# Altium project EPS.PrjPcb (part 3 of 4)

## Sheet EPS_Distribution_LCL-FPF.SchDoc: Distribution / LCL-FPF
size A4; ApprovedBy: (not approved); CheckedBy: (not checked); Author: Piotr Kuligowski; DocumentNumber: PWSat2-xxx-DW-xxx; Revision: 3; SheetNumber: 51; SheetTotal: 51; Model: FPM
Used 6 times, as channels Top/Distribution/LCL-FPF SunS 3V3, Top/Distribution/LCL-FPF CAMnadir 3V3, Top/Distribution/LCL-FPF CAMwing 3V3, Top/Distribution/LCL-FPF SENS 5V, Top/Distribution/LCL-FPF ANTs 5V, Top/Distribution/LCL-FPF ANTs 5V. Parts and nets are listed once, with the designators drawn on the sheet.
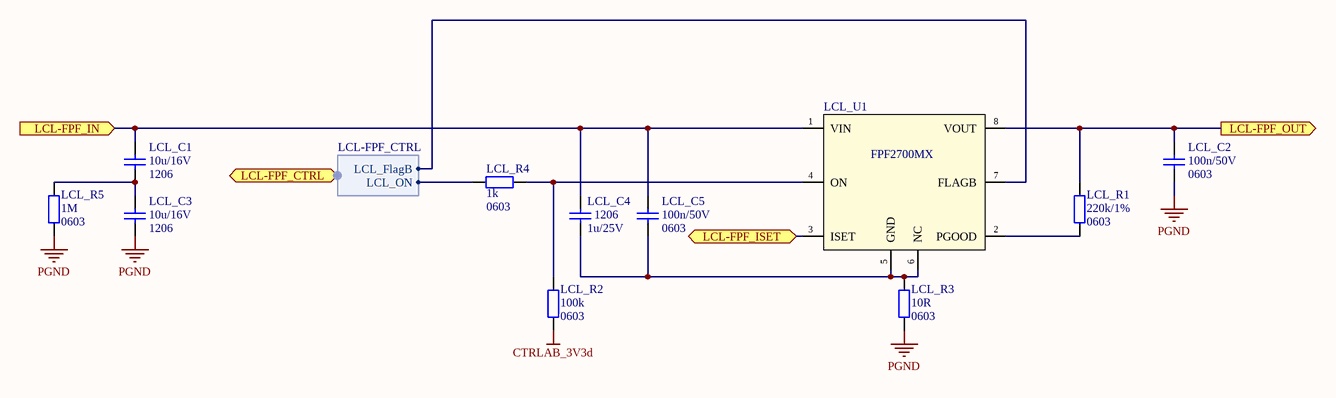
[diagram p23: EPS_Distribution_LCL-FPF.SchDoc]

### Parts
LCL_C1  Packge: 1206  [SMD_Capacitor_1206]  (hidden comment: 10u/16V)
LCL_C2  Package: 0603  [SMD_Capacitor_0603]  (hidden comment: 100n/50V)
LCL_C3  Packge: 1206  [SMD_Capacitor_1206]  (hidden comment: 10u/16V)
LCL_C4  Package: 1206  [SMD_Capacitor_1206]  (hidden comment: 1u/25V)
LCL_C5  Package: 0603  [SMD_Capacitor_0603]  (hidden comment: 100n/50V)
LCL_R1  Package: 0603  [SMD_Resistor_0603]  (hidden comment: 220k/1%)
LCL_R2  Package: 0603  [SMD_Resistor_0603]  (hidden comment: 100k)
LCL_R3  Package: 0603  [SMD_Resistor_0603]  (hidden comment: 10R)
LCL_R4  Package: 0603  [SMD_Resistor_0603]  (hidden comment: 1k)
LCL_R5  Package: 0603  [SMD_Resistor_0603]  (hidden comment: 1M)
LCL_U1  FPF2700MX  [SOIC-8-N]

### Ports
LCL-FPF_CTRL (harness LCL-FPF_CTRL), LCL-FPF_IN (in), LCL-FPF_ISET, LCL-FPF_OUT (out)

### Harnesses
LCL-FPF_CTRL: LCL_FlagB, LCL_ON

### Nets
CTRLAB_3V3d: LCL_R2.1
PGND: LCL_C2.2 LCL_C3.2 LCL_R3.1 LCL_R5.1
LCL-FPF_IN: LCL_C1.1 LCL_C4.1 LCL_C5.1 LCL_U1.1(VIN) ; port LCL-FPF_IN
LCL-FPF_ISET: LCL_U1.3(ISET) ; port LCL-FPF_ISET
LCL-FPF_OUT: LCL_C2.1 LCL_R1.2 LCL_U1.8(VOUT) ; port LCL-FPF_OUT
NetLCL_C1_2: LCL_C1.2 LCL_C3.1 LCL_R5.2
NetLCL_C4_2: LCL_C4.2 LCL_C5.2 LCL_R3.2 LCL_U1.5(GND) LCL_U1.6(NC)
NetLCL_R1_1: LCL_R1.1 LCL_U1.2(PGOOD)
NetLCL_R2_2: LCL_R2.2 LCL_R4.1 LCL_U1.4(ON)
NetLCL_R4_2: LCL_R4.2 ; port LCL-FPF_CTRL.LCL_ON
NetLCL_U1_7: LCL_U1.7(FLAGB) ; port LCL-FPF_CTRL.LCL_FlagB

### Channels
Top/Distribution/LCL-FPF SunS 3V3: designators end in _1; ports LCL-FPF_IN=NetHK_R1_2_1 LCL-FPF_ISET=NetDISTR_R1_2 LCL-FPF_OUT=PC-104_LCL_SunS_3V3
Top/Distribution/LCL-FPF CAMnadir 3V3: designators end in _2; ports LCL-FPF_IN=NetHK_R1_2_1 LCL-FPF_ISET=NetDISTR_R2_2 LCL-FPF_OUT=PC-104_LCL_CAMnadir_3V3
Top/Distribution/LCL-FPF CAMwing 3V3: designators end in _3; ports LCL-FPF_IN=NetHK_R1_2_1 LCL-FPF_ISET=NetDISTR_R3_2 LCL-FPF_OUT=PC-104_LCL_CAMwing_3V3
Top/Distribution/LCL-FPF SENS 5V: designators end in _4; ports LCL-FPF_IN=NetHK_R1_1_1 LCL-FPF_ISET=NetDISTR_R4_2 LCL-FPF_OUT=PC-104_LCL_SENS_5V
Top/Distribution/LCL-FPF ANTs 5V: designators end in _5; ports LCL-FPF_IN=NetHK_R1_1_1 LCL-FPF_ISET=NetDISTR_R5_2 LCL-FPF_OUT=NetH8_1
Top/Distribution/LCL-FPF ANTs 5V: designators end in _6; ports LCL-FPF_IN=NetHK_R1_1_1 LCL-FPF_ISET=NetDISTR_R6_2 LCL-FPF_OUT=NetH8_1

### Notes on the sheet
- Title:
- Project:
- Author:
- Model:
- Document Number:
- Checked by:
- Rev:
- Date:
- Approved by:
- Sheet:
- of
- File name:

### Library data of the parts
LCL_C1 LCL_C3 = Cer_C1206T106K4RACTU: Ceramic Cap Kemet COTS 10u/16V X7R 1206; ManufacturerPartNumber: C1206T106K4RACTU; Manufacturer: Kemet; Value: 10u/16V
LCL_C2 LCL_C5 = Cer_C0603T104K5RALTU: Ceramic Cap Kemet COTS 100n/50V X7R 0603; Manufacturer: Kemet; ManufacturerPartNumber: C0603T104K5RALTU; Value: 100n/50V
LCL_C4 = Cer_C1206T105K3RALTU: Ceramic Cap Kemet COTS 1u/25V X7R 1206; ManufacturerPartNumber: C1206T105K3RALTU; Manufacturer: Kemet; Value: 1u/25V
LCL_R1-LCL_R5 = Res
  LCL_R1: Value: 220k/1%
  LCL_R2: Value: 100k
  LCL_R3: Value: 10R
  LCL_R4: Value: 1k
  LCL_R5: Value: 1M
LCL_U1 = FPF2700MX: Adj over-current protection 0.4-2A, Load Switch; Manufacturer: Fairchild Semiconductor; Value: FPF2700MX

## Sheet EPS_Distribution_LCL-TK.SchDoc: Distribution / LCL-TK
size A3; ApprovedBy: (not approved); CheckedBy: (not checked); Author: Piotr Kuligowski; DocumentNumber: PWSat2-xxx-DW-xxx; Revision: 3; SheetNumber: 50; SheetTotal: 51; Model: FPM
Used 2 times, as channels Top/Distribution/LCL-TK MAIN, Top/Distribution/LCL-TK Redundant. Parts and nets are listed once, with the designators drawn on the sheet.
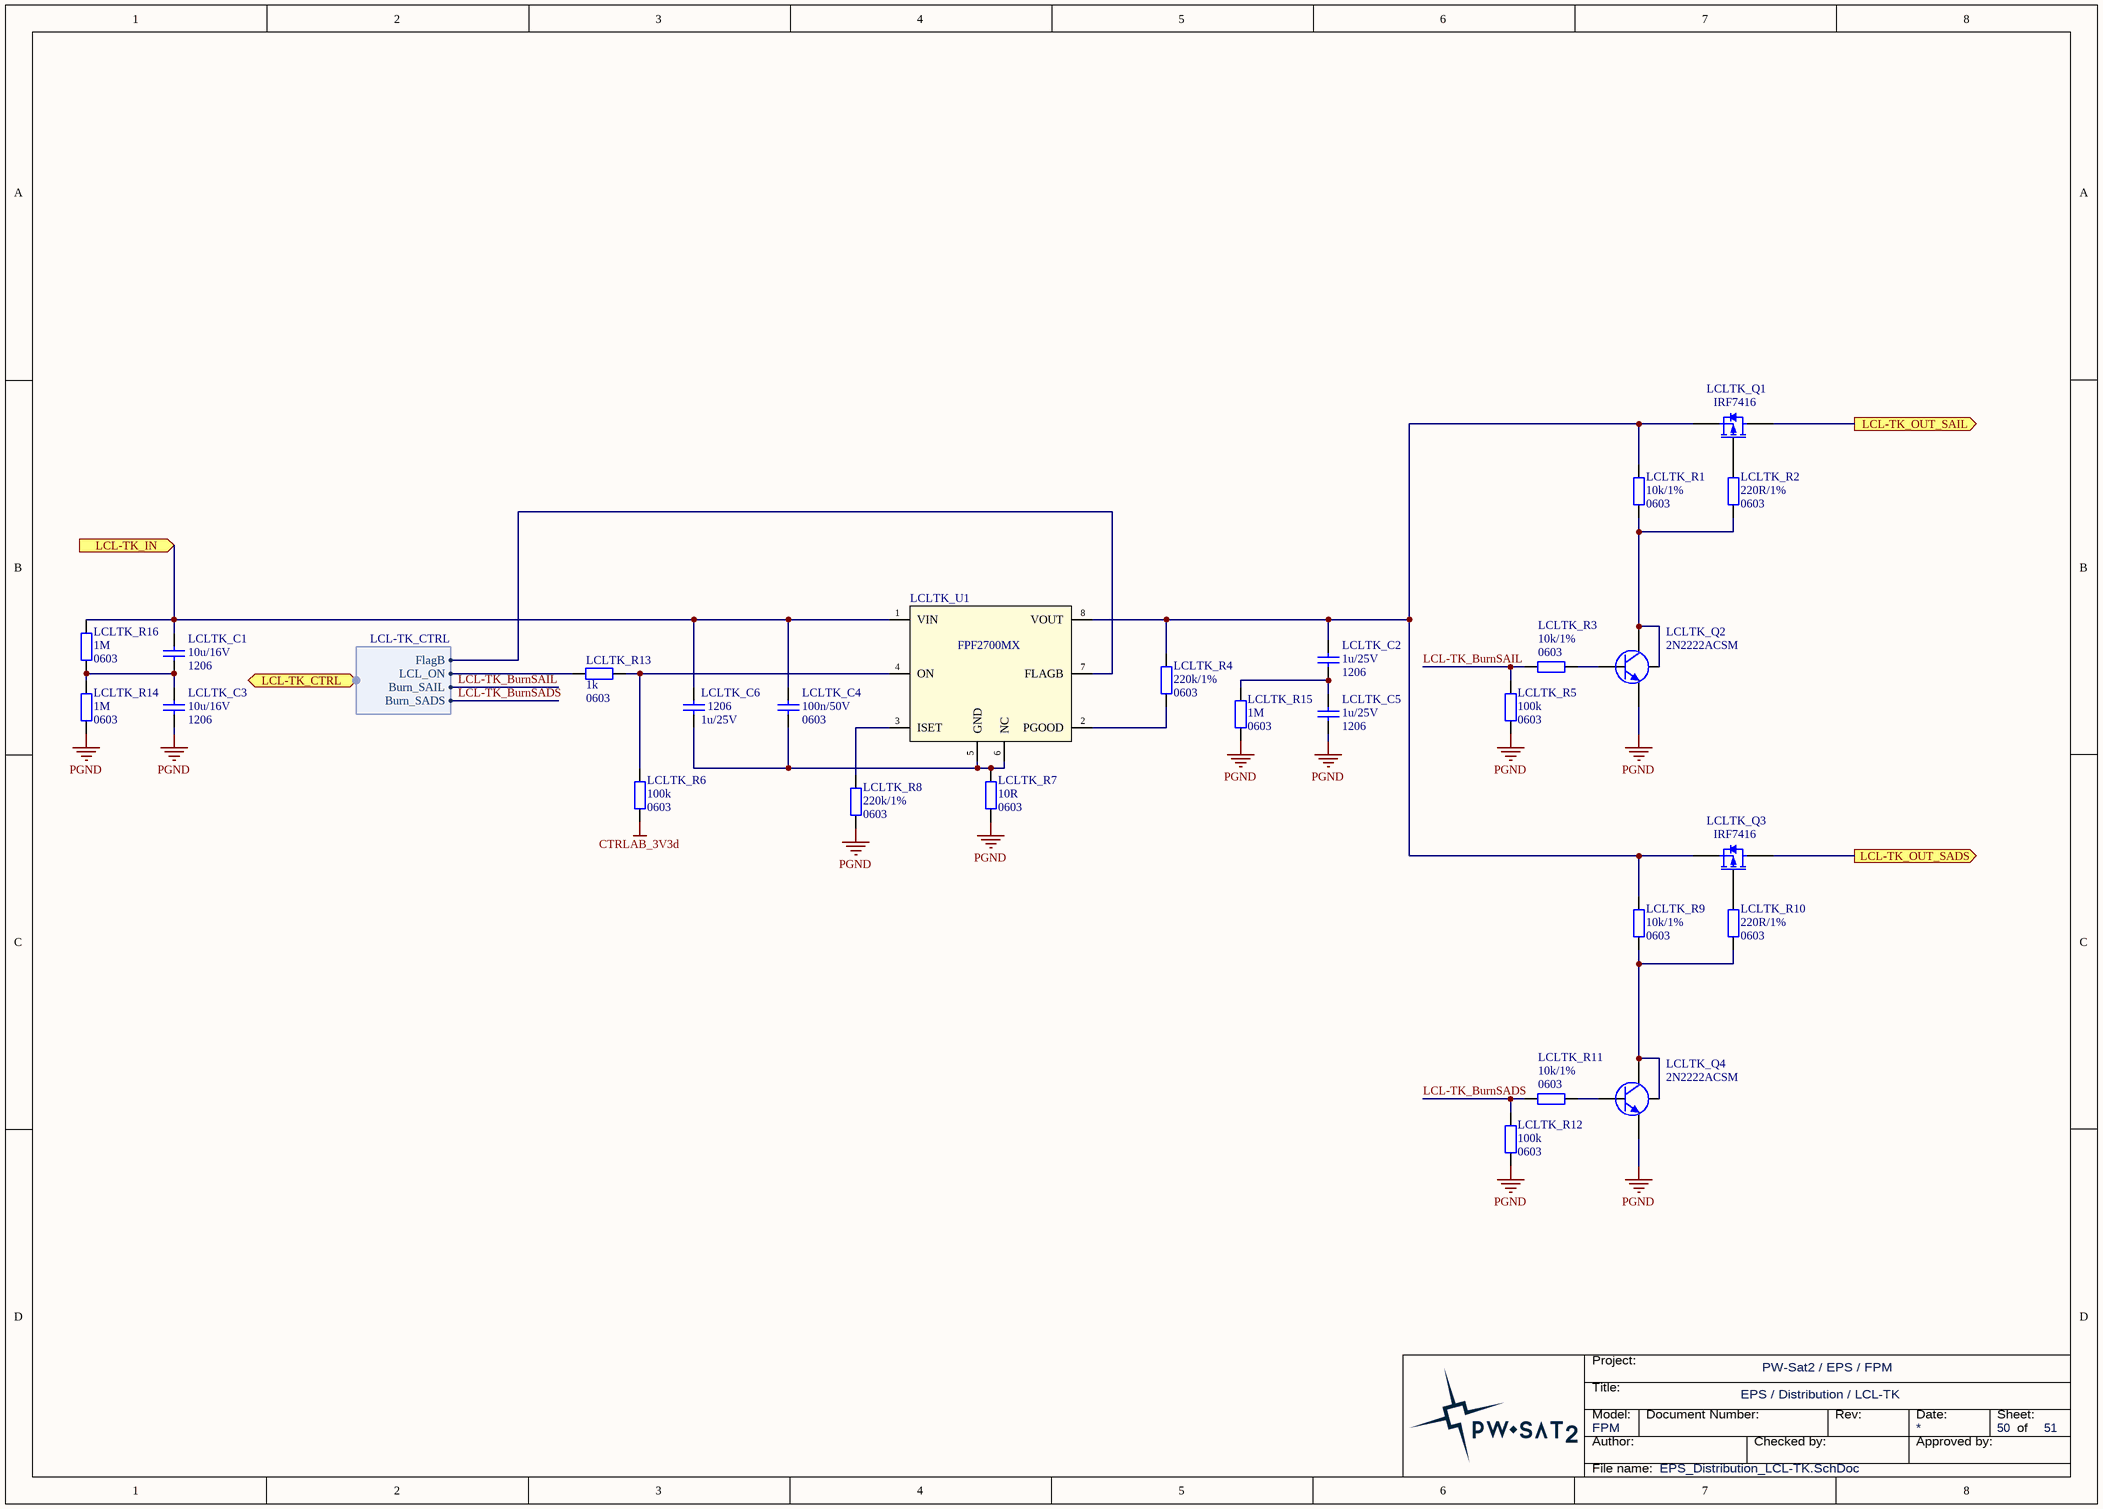
[diagram p24: EPS_Distribution_LCL-TK.SchDoc]

### Parts
LCLTK_C1  Packge: 1206  [SMD_Capacitor_1206]  (hidden comment: 10u/16V)
LCLTK_C2  Package: 1206  [SMD_Capacitor_1206]  (hidden comment: 1u/25V)
LCLTK_C3  Packge: 1206  [SMD_Capacitor_1206]  (hidden comment: 10u/16V)
LCLTK_C4  Package: 0603  [SMD_Capacitor_0603]  (hidden comment: 100n/50V)
LCLTK_C5  Package: 1206  [SMD_Capacitor_1206]  (hidden comment: 1u/25V)
LCLTK_C6  Package: 1206  [SMD_Capacitor_1206]  (hidden comment: 1u/25V)
LCLTK_Q1  IRF7416  [SOIC-8-N_SSSGDDDD]
LCLTK_Q2  2N2222ACSM  [LCC1-4_BEC]
LCLTK_Q3  IRF7416  [SOIC-8-N_SSSGDDDD]
LCLTK_Q4  2N2222ACSM  [LCC1-4_BEC]
LCLTK_R1  Package: 0603  [SMD_Resistor_0603]  (hidden comment: 10k/1%)
LCLTK_R2  Package: 0603  [SMD_Resistor_0603]  (hidden comment: 220R/1%)
LCLTK_R3  Package: 0603  [SMD_Resistor_0603]  (hidden comment: 10k/1%)
LCLTK_R4  Package: 0603  [SMD_Resistor_0603]  (hidden comment: 220k/1%)
LCLTK_R5  Package: 0603  [SMD_Resistor_0603]  (hidden comment: 100k)
LCLTK_R6  Package: 0603  [SMD_Resistor_0603]  (hidden comment: 100k)
LCLTK_R7  Package: 0603  [SMD_Resistor_0603]  (hidden comment: 10R)
LCLTK_R8  Package: 0603  [SMD_Resistor_0603]  (hidden comment: 220k/1%)
LCLTK_R9  Package: 0603  [SMD_Resistor_0603]  (hidden comment: 10k/1%)
LCLTK_R10  Package: 0603  [SMD_Resistor_0603]  (hidden comment: 220R/1%)
LCLTK_R11  Package: 0603  [SMD_Resistor_0603]  (hidden comment: 10k/1%)
LCLTK_R12  Package: 0603  [SMD_Resistor_0603]  (hidden comment: 100k)
LCLTK_R13  Package: 0603  [SMD_Resistor_0603]  (hidden comment: 1k)
LCLTK_R14  Package: 0603  [SMD_Resistor_0603]  (hidden comment: 1M)
LCLTK_R15  Package: 0603  [SMD_Resistor_0603]  (hidden comment: 1M)
LCLTK_R16  Package: 0603  [SMD_Resistor_0603]  (hidden comment: 1M)
LCLTK_U1  FPF2700MX  [SOIC-8-N]

### Ports
LCL-TK_CTRL (harness LCL-TK_CTRL), LCL-TK_IN (in), LCL-TK_OUT_SADS (out), LCL-TK_OUT_SAIL (out)

### Harnesses
LCL-TK_CTRL: FlagB, LCL_ON, Burn_SAIL, Burn_SADS

### Nets
CTRLAB_3V3d: LCLTK_R6.1
PGND: LCLTK_C3.2 LCLTK_C5.2 LCLTK_Q2.E LCLTK_Q4.E LCLTK_R5.1 LCLTK_R7.1 LCLTK_R8.1 LCLTK_R12.1 LCLTK_R14.1 LCLTK_R15.1
LCL-TK_BurnSADS: LCLTK_R11.2 LCLTK_R12.2 ; port LCL-TK_CTRL.Burn_SADS
LCL-TK_BurnSAIL: LCLTK_R3.2 LCLTK_R5.2 ; port LCL-TK_CTRL.Burn_SAIL
LCL-TK_IN: LCLTK_C1.1 LCLTK_C4.1 LCLTK_C6.1 LCLTK_R16.2 LCLTK_U1.1(VIN) ; port LCL-TK_IN
LCL-TK_OUT_SADS: LCLTK_Q3.D ; port LCL-TK_OUT_SADS
LCL-TK_OUT_SAIL: LCLTK_Q1.D ; port LCL-TK_OUT_SAIL
NetLCLTK_C1_2: LCLTK_C1.2 LCLTK_C3.1 LCLTK_R14.2 LCLTK_R16.1
NetLCLTK_C2_1: LCLTK_C2.1 LCLTK_Q1.S LCLTK_Q3.S LCLTK_R1.2 LCLTK_R4.2 LCLTK_R9.2 LCLTK_U1.8(VOUT)
NetLCLTK_C2_2: LCLTK_C2.2 LCLTK_C5.1 LCLTK_R15.2
NetLCLTK_C4_2: LCLTK_C4.2 LCLTK_C6.2 LCLTK_R7.2 LCLTK_U1.5(GND) LCLTK_U1.6(NC)
NetLCLTK_Q1_G: LCLTK_Q1.G LCLTK_R2.2
NetLCLTK_Q2_B: LCLTK_Q2.B LCLTK_R3.1
NetLCLTK_Q2_C: LCLTK_Q2.C LCLTK_Q2.Shield LCLTK_R1.1 LCLTK_R2.1
NetLCLTK_Q3_G: LCLTK_Q3.G LCLTK_R10.2
NetLCLTK_Q4_B: LCLTK_Q4.B LCLTK_R11.1
NetLCLTK_Q4_C: LCLTK_Q4.C LCLTK_Q4.Shield LCLTK_R9.1 LCLTK_R10.1
NetLCLTK_R4_1: LCLTK_R4.1 LCLTK_U1.2(PGOOD)
NetLCLTK_R6_2: LCLTK_R6.2 LCLTK_R13.1 LCLTK_U1.4(ON)
NetLCLTK_R8_2: LCLTK_R8.2 LCLTK_U1.3(ISET)
NetLCLTK_R13_2: LCLTK_R13.2 ; port LCL-TK_CTRL.LCL_ON
NetLCLTK_U1_7: LCLTK_U1.7(FLAGB) ; port LCL-TK_CTRL.FlagB

### Channels
Top/Distribution/LCL-TK MAIN: designators end in _1; ports LCL-TK_IN=NetDRLCL_C1_1_1 LCL-TK_OUT_SADS=PC-104_LCL_SADSmain LCL-TK_OUT_SAIL=PC-104_LCL_SAILmain
Top/Distribution/LCL-TK Redundant: designators end in _2; ports LCL-TK_IN=NetDRLCL_C1_1_1 LCL-TK_OUT_SADS=PC-104_LCL_SADSred LCL-TK_OUT_SAIL=PC-104_LCL_SAILred

### Notes on the sheet
- Title:
- Project:
- Author:
- Model:
- Document Number:
- Checked by:
- Rev:
- Date:
- Approved by:
- Sheet:
- of
- File name:

### Library data of the parts
LCLTK_C1 LCLTK_C3 = Cer_C1206T106K4RACTU: Ceramic Cap Kemet COTS 10u/16V X7R 1206; ManufacturerPartNumber: C1206T106K4RACTU; Manufacturer: Kemet; Value: 10u/16V
LCLTK_C2 LCLTK_C5 LCLTK_C6 = Cer_C1206T105K3RALTU: Ceramic Cap Kemet COTS 1u/25V X7R 1206; ManufacturerPartNumber: C1206T105K3RALTU; Manufacturer: Kemet; Value: 1u/25V
LCLTK_C4 = Cer_C0603T104K5RALTU: Ceramic Cap Kemet COTS 100n/50V X7R 0603; Manufacturer: Kemet; ManufacturerPartNumber: C0603T104K5RALTU; Value: 100n/50V
LCLTK_Q1 LCLTK_Q3 = IRF7416: 10A/30V HEXFET Power P-MOSFET.; Manufacturer: International Rectifier; Value: IRF7416
LCLTK_Q2 LCLTK_Q4 = 2N2222ACSM: as RBL_Q2 on sheet EPS_RBL; Value: 2N2222ACSM
LCLTK_R1-LCLTK_R16 = Res
  LCLTK_R1 LCLTK_R3 LCLTK_R9 LCLTK_R11: Value: 10k/1%
  LCLTK_R2 LCLTK_R10: Value: 220R/1%
  LCLTK_R4 LCLTK_R8: Value: 220k/1%
  LCLTK_R5 LCLTK_R6 LCLTK_R12: Value: 100k
  LCLTK_R7: Value: 10R
  LCLTK_R13: Value: 1k
  LCLTK_R14-LCLTK_R16: Value: 1M
LCLTK_U1 = FPF2700MX: as LCL_U1 on sheet EPS_Distribution_LCL-FPF; Value: FPF2700MX

## Sheet EPS_Distribution_RLCL-FPF.SchDoc: Distribution / RLCL-FPF
size A4; ApprovedBy: (not approved); CheckedBy: (not checked); Author: Piotr Kuligowski; DocumentNumber: PWSat2-xxx-DW-xxx; Revision: 3; SheetNumber: 49; SheetTotal: 51; Model: FPM
Used 2 times, as channels Top/Distribution/RLCL-FPF 5V, Top/Distribution/RLCL-FPF 3V3. Parts and nets are listed once, with the designators drawn on the sheet.
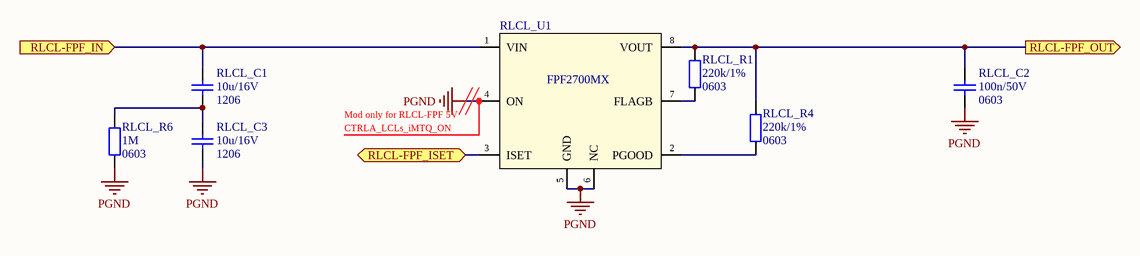
[diagram p25: EPS_Distribution_RLCL-FPF.SchDoc]

### Parts
RLCL_C1  Packge: 1206  [SMD_Capacitor_1206]  (hidden comment: 10u/16V)
RLCL_C2  Package: 0603  [SMD_Capacitor_0603]  (hidden comment: 100n/50V)
RLCL_C3  Packge: 1206  [SMD_Capacitor_1206]  (hidden comment: 10u/16V)
RLCL_R1  Package: 0603  [SMD_Resistor_0603]  (hidden comment: 220k/1%)
RLCL_R4  Package: 0603  [SMD_Resistor_0603]  (hidden comment: 220k/1%)
RLCL_R6  Package: 0603  [SMD_Resistor_0603]  (hidden comment: 1M)
RLCL_U1  FPF2700MX  [SOIC-8-N]

### Ports
RLCL-FPF_IN (in), RLCL-FPF_ISET, RLCL-FPF_OUT (out)

### Nets
PGND: RLCL_C2.2 RLCL_C3.2 RLCL_R6.1 RLCL_U1.4(ON) RLCL_U1.5(GND) RLCL_U1.6(NC)
RLCL-FPF_IN: RLCL_C1.1 RLCL_U1.1(VIN) ; port RLCL-FPF_IN
RLCL-FPF_ISET: RLCL_U1.3(ISET) ; port RLCL-FPF_ISET
RLCL-FPF_OUT: RLCL_C2.1 RLCL_R1.2 RLCL_R4.2 RLCL_U1.8(VOUT) ; port RLCL-FPF_OUT
NetRLCL_C1_2: RLCL_C1.2 RLCL_C3.1 RLCL_R6.2
NetRLCL_R1_1: RLCL_R1.1 RLCL_U1.7(FLAGB)
NetRLCL_R4_1: RLCL_R4.1 RLCL_U1.2(PGOOD)

### Channels
Top/Distribution/RLCL-FPF 5V: designators end in _1; ports RLCL-FPF_IN=NetHK_R1_1_1 RLCL-FPF_ISET=NetDISTR_R8_2 RLCL-FPF_OUT=PC-104_LCL_5V
Top/Distribution/RLCL-FPF 3V3: designators end in _2; ports RLCL-FPF_IN=NetHK_R1_2_1 RLCL-FPF_ISET=NetDISTR_R7_2 RLCL-FPF_OUT=PC-104_LCL_3V3

### Notes on the sheet
- CTRLA_LCLs_iMTQ_ON
- (near RLCL_U1) Mod only for RLCL-FPF 5V
- Title:
- Project:
- Author:
- Model:
- Document Number:
- Checked by:
- Rev:
- Date:
- Approved by:
- Sheet:
- of
- File name:

### Library data of the parts
RLCL_C1 RLCL_C3 = Cer_C1206T106K4RACTU: Ceramic Cap Kemet COTS 10u/16V X7R 1206; ManufacturerPartNumber: C1206T106K4RACTU; Manufacturer: Kemet; Value: 10u/16V
RLCL_C2 = Cer_C0603T104K5RALTU: Ceramic Cap Kemet COTS 100n/50V X7R 0603; Manufacturer: Kemet; ManufacturerPartNumber: C0603T104K5RALTU; Value: 100n/50V
RLCL_R1 RLCL_R4 RLCL_R6 = Res
  RLCL_R1 RLCL_R4: Value: 220k/1%
  RLCL_R6: Value: 1M
RLCL_U1 = FPF2700MX: Adj over-current protection 0.4-2A with auto-reset, Load Switch; Manufacturer: Fairchild Semiconductor; Value: FPF2700MX

## Sheet EPS_Distribution_Measurements.SchDoc: Distribution / Measurements
size A4; ApprovedBy: (not approved); CheckedBy: (not checked); Author: Piotr Kuligowski; DocumentNumber: PWSat2-xxx-DW-xxx; Revision: 3; SheetNumber: 48; SheetTotal: 51; Model: FPM
Used 3 times, as channels Top/Distribution/5V Measurements, Top/Distribution/3V3 Measurements, Top/Distribution/VBAT Measurements. Parts and nets are listed once, with the designators drawn on the sheet.
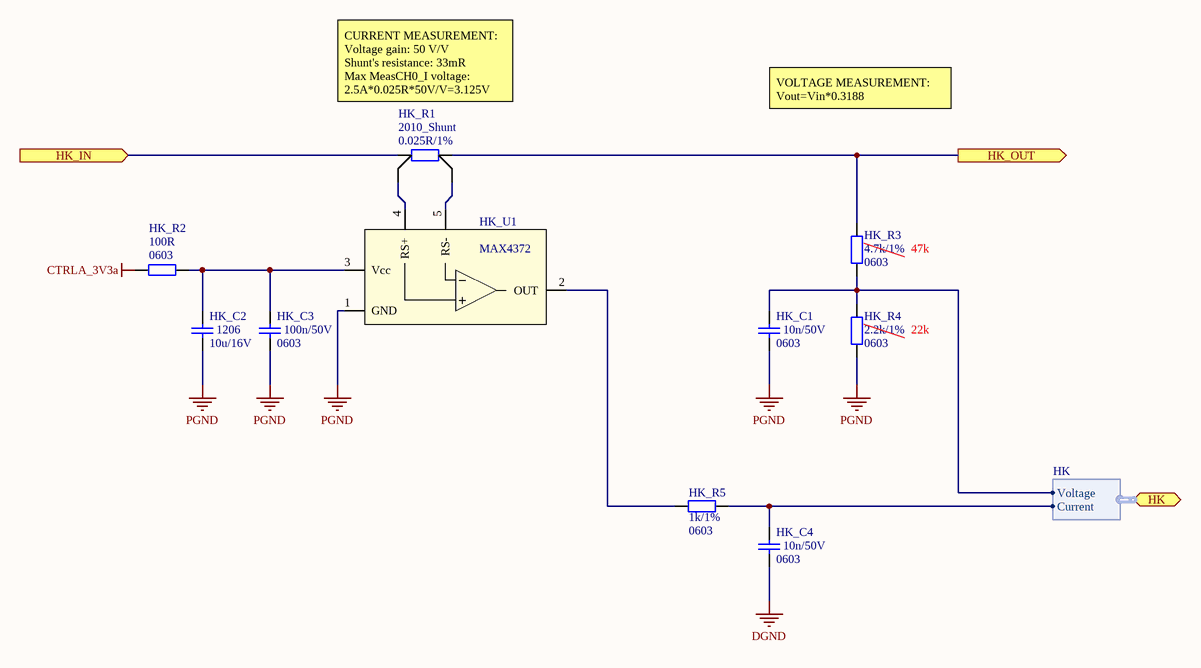
[diagram p26: EPS_Distribution_Measurements.SchDoc]

### Parts
HK_C1  Package: 0603  [SMD_Capacitor_0603]  (hidden comment: 10n/50V)
HK_C2  Packge: 1206  [SMD_Capacitor_1206]  (hidden comment: 10u/16V)
HK_C3  Package: 0603  [SMD_Capacitor_0603]  (hidden comment: 100n/50V)
HK_C4  Package: 0603  [SMD_Capacitor_0603]  (hidden comment: 10n/50V)
HK_R1  Package: 2010_Shunt  [SMD_Resistor-shunt_2010]  (hidden comment: 0.025R/1%)
HK_R2  Package: 0603  [SMD_Resistor_0603]  (hidden comment: 100R)
HK_R3  Package: 0603  [SMD_Resistor_0603]  (hidden comment: 4.7k/1%)
HK_R4  Package: 0603  [SMD_Resistor_0603]  (hidden comment: 2.2k/1%)
HK_R5  Package: 0603  [SMD_Resistor_0603]  (hidden comment: 1k/1%)
HK_U1  MAX4372  [SOT23-5]

### Ports
HK (harness HK), HK_IN (in), HK_OUT (out)

### Harnesses
HK: Voltage, Current

### Nets
CTRLA_3V3a: HK_R2.1
DGND: HK_C4.2
PGND: HK_C1.2 HK_C2.2 HK_C3.2 HK_R4.2 HK_U1.1(GND)
HK_IN: HK_R1.4 ; port HK_IN
HK_OUT: HK_R1.1 HK_R3.1 ; port HK_OUT
NetHK_C1_1: HK_C1.1 HK_R3.2 HK_R4.1 ; port HK.Voltage
NetHK_C2_1: HK_C2.1 HK_C3.1 HK_R2.2 HK_U1.3(Vcc)
NetHK_C4_1: HK_C4.1 HK_R5.2 ; port HK.Current
NetHK_R1_2: HK_R1.2 HK_U1.5(RS-)
NetHK_R1_3: HK_R1.3 HK_U1.4(RS+)
NetHK_R5_1: HK_R5.1 HK_U1.2(OUT)

### Channels
Top/Distribution/5V Measurements: designators end in _1; ports HK_IN=NetEMIBB_C1_1 HK_OUT=NetHK_R1_1_1
Top/Distribution/3V3 Measurements: designators end in _2; ports HK_IN=NetHK_R1_2_4 HK_OUT=NetHK_R1_2_1
Top/Distribution/VBAT Measurements: designators end in _3; ports HK_IN=NetHK_R1_3_4 HK_OUT=PC-104_LCL_VBAT

### Notes on the sheet
- CURRENT MEASUREMENT:
  Voltage gain: 50 V/V
  Shunt's resistance: 33mR
  Max MeasCH0_I voltage: 2.5A*0.025R*50V/V=3.125V
- VOLTAGE MEASUREMENT:
  Vout=Vin*0.3188
- 47k
- 22k
- Title:
- Project:
- Author:
- Model:
- Document Number:
- Checked by:
- Rev:
- Date:
- Approved by:
- Sheet:
- of
- File name:

### Library data of the parts
HK_C1 HK_C3 HK_C4 = Cer_C0603T104K5RALTU: Ceramic Cap Kemet COTS 100n/50V X7R 0603; Manufacturer: Kemet; ManufacturerPartNumber: C0603T104K5RALTU
  HK_C1 HK_C4: Value: 10n/50V
  HK_C3: Value: 100n/50V
HK_C2 = Cer_C1206T106K4RACTU: Ceramic Cap Kemet COTS 10u/16V X7R 1206; ManufacturerPartNumber: C1206T106K4RACTU; Manufacturer: Kemet; Value: 10u/16V
HK_R1 = CS10FTHTR025: 1W current sensing shunt resistor; Manufacturer: Viking; Supplier 1: TME; TME: CS2010-0R025-1%-HP; ManufacturerPartNumber: CS10FTHTR025; Value: 0.025R/1%
HK_R2-HK_R5 = Res
  HK_R2: Value: 100R
  HK_R3: Value: 4.7k/1%
  HK_R4: Value: 2.2k/1%
  HK_R5: Value: 1k/1%
HK_U1 = MAX4372: as MEAS_U1 on sheet EPS_MPPT_XY_Measurements; Value: MAX4372

## Sheet EPS_VBAT.SchDoc: VBAT
size A4; ApprovedBy: (not approved); CheckedBy: (not checked); Author: Piotr Kuligowski; DocumentNumber: PWSat2-xxx-DW-xxx; Revision: 3; SheetNumber: 37; SheetTotal: 51; Model: FPM
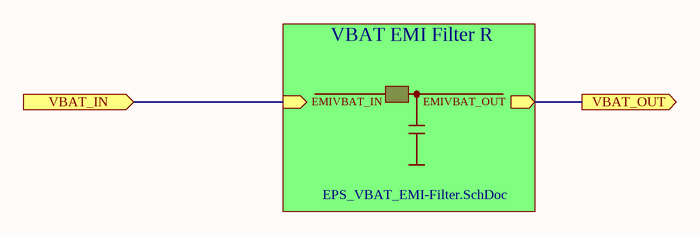
[diagram p27: EPS_VBAT.SchDoc]

### Sub-sheets
VBAT EMI Filter R = EPS_VBAT_EMI-Filter.SchDoc (file not in this document): EMIVBAT_OUT (out), EMIVBAT_IN (in)

### Ports
VBAT_IN (in), VBAT_OUT (out)

### Nets
NetDRLCL_C4_2_1: port VBAT_IN, sheet VBAT EMI Filter R/EMIVBAT_IN
NetHK_R1_3_4: port VBAT_OUT, sheet VBAT EMI Filter R/EMIVBAT_OUT

### Notes on the sheet
- Title:
- Project:
- Author:
- Model:
- Document Number:
- Checked by:
- Rev:
- Date:
- Approved by:
- Sheet:
- of
- File name:

## Sheet EPS_DCDC_RLCLs.SchDoc: DCDC / RLCLs
size A4; ApprovedBy: (not approved); CheckedBy: (not checked); Author: Piotr Kuligowski; DocumentNumber: PWSat2-xxx-DW-xxx; Revision: 3; SheetNumber: 36; SheetTotal: 51; Model: FPM
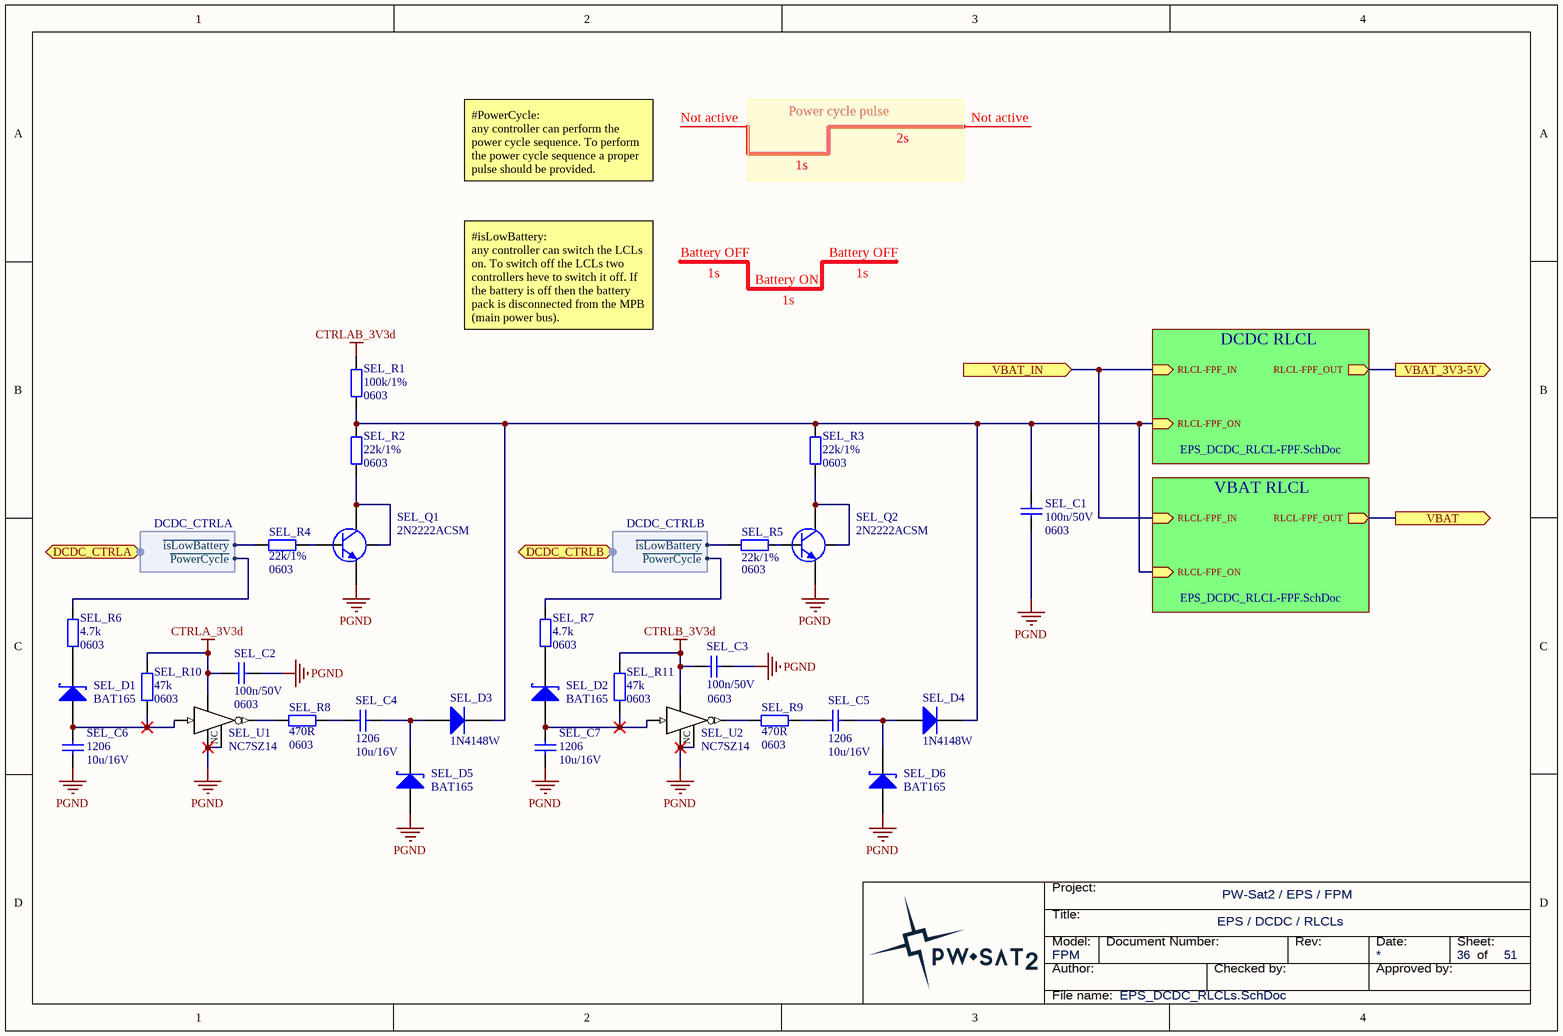
[diagram p28: EPS_DCDC_RLCLs.SchDoc]

### Parts
SEL_C1  value 100n/50V  Package: 0603  [SMD_Capacitor_0603]  (hidden comment: Cap)
SEL_C2  Package: 0603  [SMD_Capacitor_0603]  (hidden comment: 100n/50V)
SEL_C3  Package: 0603  [SMD_Capacitor_0603]  (hidden comment: 100n/50V)
SEL_C4  Packge: 1206  [SMD_Capacitor_1206]  (hidden comment: 10u/16V)
SEL_C5  Packge: 1206  [SMD_Capacitor_1206]  (hidden comment: 10u/16V)
SEL_C6  Packge: 1206  [SMD_Capacitor_1206]  (hidden comment: 10u/16V)
SEL_C7  Packge: 1206  [SMD_Capacitor_1206]  (hidden comment: 10u/16V)
SEL_D1  BAT165  [SOD323]
SEL_D2  BAT165  [SOD323]
SEL_D3  1N4148W  [SOD-123]
SEL_D4  1N4148W  [SOD-123]
SEL_D5  BAT165  [SOD323]
SEL_D6  BAT165  [SOD323]
SEL_Q1  2N2222ACSM  [LCC1-4_BEC]
SEL_Q2  2N2222ACSM  [LCC1-4_BEC]
SEL_R1  Package: 0603  [SMD_Resistor_0603]  (hidden comment: 100k/1%)
SEL_R2  Package: 0603  [SMD_Resistor_0603]  (hidden comment: 22k/1%)
SEL_R3  Package: 0603  [SMD_Resistor_0603]  (hidden comment: 22k/1%)
SEL_R4  Package: 0603  [SMD_Resistor_0603]  (hidden comment: 22k/1%)
SEL_R5  Package: 0603  [SMD_Resistor_0603]  (hidden comment: 22k/1%)
SEL_R6  Package: 0603  [SMD_Resistor_0603]  (hidden comment: 4.7k)
SEL_R7  Package: 0603  [SMD_Resistor_0603]  (hidden comment: 4.7k)
SEL_R8  Package: 0603  [SMD_Resistor_0603]  (hidden comment: 470R)
SEL_R9  Package: 0603  [SMD_Resistor_0603]  (hidden comment: 470R)
SEL_R10  Package: 0603  [SMD_Resistor_0603]  (hidden comment: 47k)
SEL_R11  Package: 0603  [SMD_Resistor_0603]  (hidden comment: 47k)
SEL_U1  NC7SZ14  [SOT23-5]
SEL_U2  NC7SZ14  [SOT23-5]

### Sub-sheets
DCDC RLCL = EPS_DCDC_RLCL-FPF.SchDoc: RLCL-FPF_IN (in), RLCL-FPF_OUT (out), RLCL-FPF_ON (in)
VBAT RLCL = EPS_DCDC_RLCL-FPF.SchDoc: RLCL-FPF_IN (in), RLCL-FPF_OUT (out), RLCL-FPF_ON (in)

### Ports
DCDC_CTRLA (harness DCDC_CTRLA), DCDC_CTRLB (harness DCDC_CTRLB), VBAT (out), VBAT_3V3-5V (out), VBAT_IN (in)

### Harnesses
DCDC_CTRLB: ~{PowerCycle}, ~{isLowBattery}
DCDC_CTRLA: ~{PowerCycle}, ~{isLowBattery}

### Nets
CTRLA_3V3d: SEL_C2.1 SEL_R10.2 SEL_U1.5(Vcc)
CTRLAB_3V3d: SEL_R1.2
CTRLB_3V3d: SEL_C3.1 SEL_R11.2 SEL_U2.5(Vcc)
PGND: SEL_C1.2 SEL_C2.2 SEL_C3.2 SEL_C6.1 SEL_C7.1 SEL_D5.A SEL_D6.A SEL_Q1.E SEL_Q2.E SEL_U1.1(NC) SEL_U1.3(GND) SEL_U2.1(NC) SEL_U2.3(GND)
NetCTRLB_U1_13: SEL_R5.1 ; port DCDC_CTRLB.~{isLowBattery}
NetCTRLB_U1_14: SEL_R7.2 ; port DCDC_CTRLB.~{PowerCycle}
NetDRLCL_C1_1_1: port VBAT_IN, sheet DCDC RLCL/RLCL-FPF_IN, sheet VBAT RLCL/RLCL-FPF_IN
NetDRLCL_C4_1_1: port VBAT_3V3-5V, sheet DCDC RLCL/RLCL-FPF_OUT
NetDRLCL_C4_2_1: port VBAT, sheet VBAT RLCL/RLCL-FPF_OUT
NetDRLCL_U1_1_4: SEL_C1.1 SEL_D3.K SEL_D4.K SEL_R1.1 SEL_R2.2 SEL_R3.2 ; sheet DCDC RLCL/RLCL-FPF_ON, sheet VBAT RLCL/RLCL-FPF_ON
NetSEL_C4_1: SEL_C4.1 SEL_R8.2
NetSEL_C4_2: SEL_C4.2 SEL_D3.A SEL_D5.K
NetSEL_C5_1: SEL_C5.1 SEL_R9.2
NetSEL_C5_2: SEL_C5.2 SEL_D4.A SEL_D6.K
NetSEL_C6_2: SEL_C6.2 SEL_D1.A SEL_R10.1 SEL_U1.2(A)
NetSEL_C7_2: SEL_C7.2 SEL_D2.A SEL_R11.1 SEL_U2.2(A)
NetSEL_D1_K: SEL_D1.K SEL_R6.1
NetSEL_D2_K: SEL_D2.K SEL_R7.1
NetSEL_Q1_B: SEL_Q1.B SEL_R4.2
NetSEL_Q1_C: SEL_Q1.C SEL_Q1.Shield SEL_R2.1
NetSEL_Q2_B: SEL_Q2.B SEL_R5.2
NetSEL_Q2_C: SEL_Q2.C SEL_Q2.Shield SEL_R3.1
NetSEL_R4_1: SEL_R4.1 ; port DCDC_CTRLA.~{isLowBattery}
NetSEL_R6_2: SEL_R6.2 ; port DCDC_CTRLA.~{PowerCycle}
NetSEL_R8_1: SEL_R8.1 SEL_U1.4(Y)
NetSEL_R9_1: SEL_R9.1 SEL_U2.4(Y)

### Notes on the sheet
- Power cycle pulse
- #PowerCycle:
  any controller can perform the power cycle sequence. To perform the power cycle sequence a proper pulse should be provided.
- Not active
- 1s
- 2s
- Battery OFF
- Battery ON
- #isLowBattery:
  any controller can switch the LCLs on. To switch off the LCLs two controllers heve to switch it off. If the battery is off then the battery pack is disconnected from the MPB (main power bus).
- Title:
- Project:
- Author:
- Model:
- Document Number:
- Checked by:
- Rev:
- Date:
- Approved by:
- Sheet:
- of
- File name:

### Library data of the parts
SEL_C2 SEL_C3 = Cer_C0603T104K5RALTU: Ceramic Cap Kemet COTS 100n/50V X7R 0603; Manufacturer: Kemet; ManufacturerPartNumber: C0603T104K5RALTU; Value: 100n/50V
SEL_C4-SEL_C7 = Cer_C1206T106K4RACTU: Ceramic Cap Kemet COTS 10u/16V X7R 1206; ManufacturerPartNumber: C1206T106K4RACTU; Manufacturer: Kemet; Value: 10u/16V
SEL_D1 SEL_D2 SEL_D5 SEL_D6 = BAT165: Madium Power AF Schottky 750mA 40V Diode; Manufacturer: Infineon; Value: BAT165
SEL_D3 SEL_D4 = 1N4148W: Small Signal Fast Switching Diode; Manufacturer: Vishay; Value: 1N4148W
SEL_Q1 SEL_Q2 = 2N2222ACSM: Silicon Planar Epitaxial NPN Transistor.; Manufacturer: Semelab-TT; Value: 2N2222ACSM
SEL_R1-SEL_R11 = Res
  SEL_R1: Value: 100k/1%
  SEL_R2-SEL_R5: Value: 22k/1%
  SEL_R6 SEL_R7: Value: 4.7k
  SEL_R8 SEL_R9: Value: 470R
  SEL_R10 SEL_R11: Value: 47k
SEL_U1 SEL_U2 = NC7SZ14: TinyLogic UHS TinyLogic UHS Two-Input NAND Gate.; Manufacturer: Fairchild Semiconductor; Value: NC7SZ14

## Sheet EPS_DCDC_RLCL-FPF.SchDoc: DCDC / RLCL-FPF
size A4; ApprovedBy: (not approved); CheckedBy: (not checked); Author: Piotr Kuligowski; DocumentNumber: PWSat2-xxx-DW-xxx; Revision: 3; SheetNumber: 35; SheetTotal: 51; Model: FPM
Used 2 times, as channels Top/LCLs for DCDC/DCDC RLCL, Top/LCLs for DCDC/VBAT RLCL. Parts and nets are listed once, with the designators drawn on the sheet.
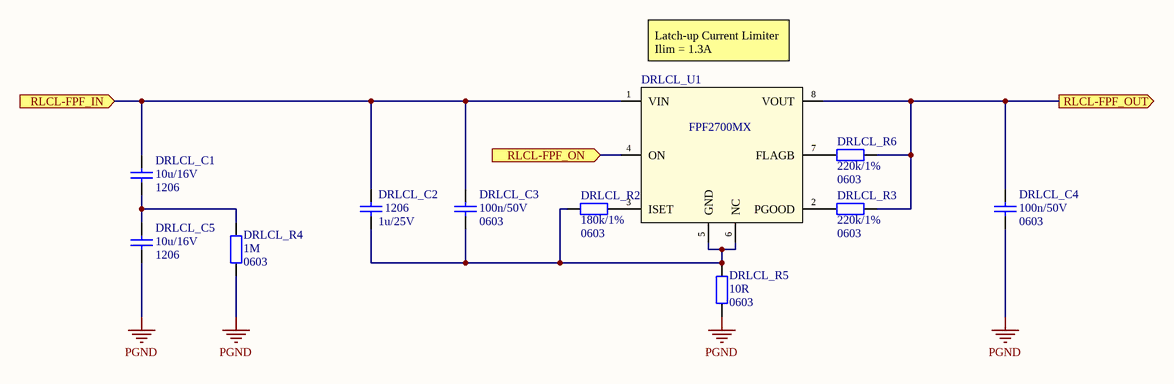
[diagram p29: EPS_DCDC_RLCL-FPF.SchDoc]

### Parts
DRLCL_C1  Packge: 1206  [SMD_Capacitor_1206]  (hidden comment: 10u/16V)
DRLCL_C2  Package: 1206  [SMD_Capacitor_1206]  (hidden comment: 1u/25V)
DRLCL_C3  Package: 0603  [SMD_Capacitor_0603]  (hidden comment: 100n/50V)
DRLCL_C4  Package: 0603  [SMD_Capacitor_0603]  (hidden comment: 100n/50V)
DRLCL_C5  Packge: 1206  [SMD_Capacitor_1206]  (hidden comment: 10u/16V)
DRLCL_R2  Package: 0603  [SMD_Resistor_0603]  (hidden comment: 180k/1%)
DRLCL_R3  Package: 0603  [SMD_Resistor_0603]  (hidden comment: 220k/1%)
DRLCL_R4  Package: 0603  [SMD_Resistor_0603]  (hidden comment: 1M)
DRLCL_R5  Package: 0603  [SMD_Resistor_0603]  (hidden comment: 10R)
DRLCL_R6  Package: 0603  [SMD_Resistor_0603]  (hidden comment: 220k/1%)
DRLCL_U1  FPF2700MX  [SOIC-8-N]

### Ports
RLCL-FPF_IN (in), RLCL-FPF_ON (in), RLCL-FPF_OUT (out)

### Nets
PGND: DRLCL_C4.2 DRLCL_C5.2 DRLCL_R4.1 DRLCL_R5.2
RLCL-FPF_IN: DRLCL_C1.1 DRLCL_C2.1 DRLCL_C3.1 DRLCL_U1.1(VIN) ; port RLCL-FPF_IN
RLCL-FPF_ON: DRLCL_U1.4(ON) ; port RLCL-FPF_ON
RLCL-FPF_OUT: DRLCL_C4.1 DRLCL_R3.2 DRLCL_R6.2 DRLCL_U1.8(VOUT) ; port RLCL-FPF_OUT
NetDRLCL_C1_2: DRLCL_C1.2 DRLCL_C5.1 DRLCL_R4.2
NetDRLCL_C2_2: DRLCL_C2.2 DRLCL_C3.2 DRLCL_R2.1 DRLCL_R5.1 DRLCL_U1.5(GND) DRLCL_U1.6(NC)
NetDRLCL_R2_2: DRLCL_R2.2 DRLCL_U1.3(ISET)
NetDRLCL_R3_1: DRLCL_R3.1 DRLCL_U1.2(PGOOD)
NetDRLCL_R6_1: DRLCL_R6.1 DRLCL_U1.7(FLAGB)

### Channels
Top/LCLs for DCDC/DCDC RLCL: designators end in _1; ports RLCL-FPF_IN=NetDRLCL_C1_1_1 RLCL-FPF_ON=NetDRLCL_U1_1_4 RLCL-FPF_OUT=NetDRLCL_C4_1_1
Top/LCLs for DCDC/VBAT RLCL: designators end in _2; ports RLCL-FPF_IN=NetDRLCL_C1_1_1 RLCL-FPF_ON=NetDRLCL_U1_1_4 RLCL-FPF_OUT=NetDRLCL_C4_2_1

### Notes on the sheet
- (near DRLCL_U1) Latch-up Current Limiter
  Ilim = 1.3A
- Title:
- Project:
- Author:
- Model:
- Document Number:
- Checked by:
- Rev:
- Date:
- Approved by:
- Sheet:
- of
- File name:

### Library data of the parts
DRLCL_C1 DRLCL_C5 = Cer_C1206T106K4RACTU: Ceramic Cap Kemet COTS 10u/16V X7R 1206; ManufacturerPartNumber: C1206T106K4RACTU; Manufacturer: Kemet; Value: 10u/16V
DRLCL_C2 = Cer_C1206T105K3RALTU: Ceramic Cap Kemet COTS 1u/25V X7R 1206; ManufacturerPartNumber: C1206T105K3RALTU; Manufacturer: Kemet; Value: 1u/25V
DRLCL_C3 DRLCL_C4 = Cer_GCJ188R71H104KA12D: Ceramic Cap Murata Automotive 100n/50V X7R 0603; Manufacturer: Murata; ManufacturerPartNumber: GCJ188R71H104KA12D; Value: 100n/50V
DRLCL_R2-DRLCL_R6 = Res
  DRLCL_R2: Value: 180k/1%
  DRLCL_R3 DRLCL_R6: Value: 220k/1%
  DRLCL_R4: Value: 1M
  DRLCL_R5: Value: 10R
DRLCL_U1 = FPF2700MX: Adj over-current protection 0.4-2A, Load Switch; Manufacturer: Fairchild Semiconductor; Value: FPF2700MX

## Sheet EPS_Local-Supply.SchDoc: Local Supply
size A4; ApprovedBy: (not approved); CheckedBy: (not checked); Author: Piotr Kuligowski; DocumentNumber: PWSat2-xxx-DW-xxx; Revision: 3; SheetNumber: 33; SheetTotal: 51; Model: FPM
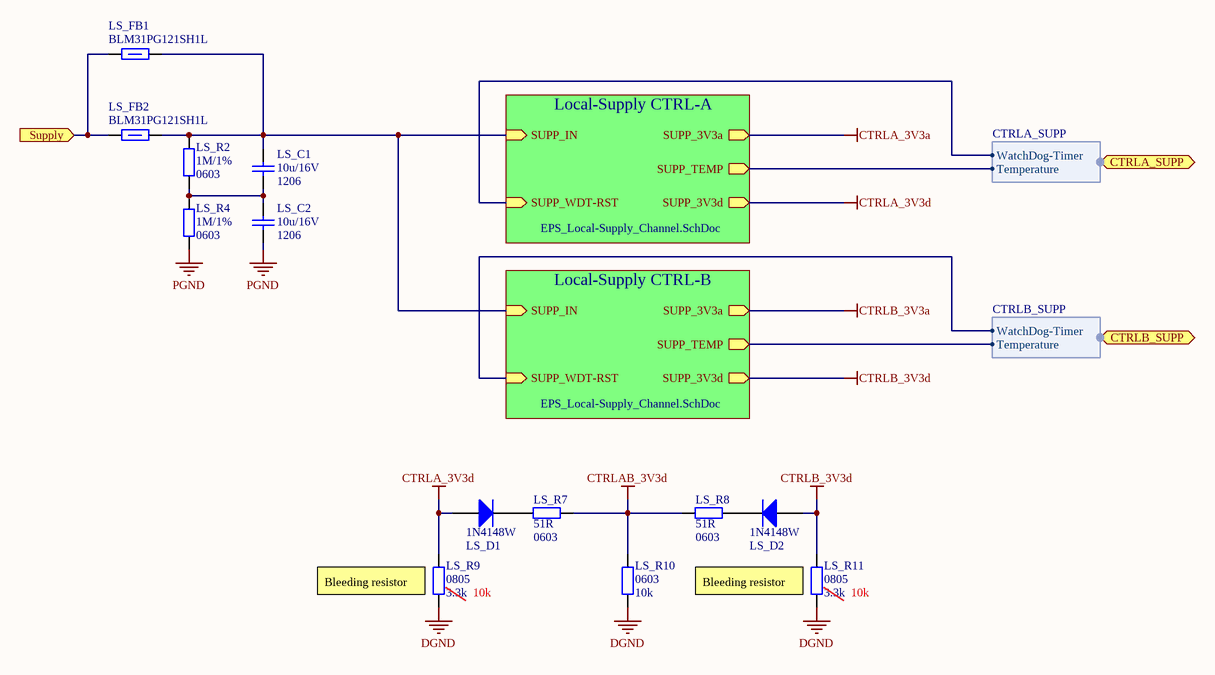
[diagram p30: EPS_Local-Supply.SchDoc]

### Parts
LS_C1  Packge: 1206  [SMD_Capacitor_1206]  (hidden comment: 10u/16V)
LS_C2  Packge: 1206  [SMD_Capacitor_1206]  (hidden comment: 10u/16V)
LS_D1  1N4148W  [SOD-123]
LS_D2  1N4148W  [SOD-123]
LS_FB1  120R/100MHz  [SMD_FerriteBead_1206]  (value not drawn)
LS_FB2  120R/100MHz  [SMD_FerriteBead_1206]  (value not drawn)
LS_R2  Package: 0603  [SMD_Resistor_0603]  (hidden comment: 1M/1%)
LS_R4  Package: 0603  [SMD_Resistor_0603]  (hidden comment: 1M/1%)
LS_R7  Package: 0603  [SMD_Resistor_0603]  (hidden comment: 51R)
LS_R8  Package: 0603  [SMD_Resistor_0603]  (hidden comment: 51R)
LS_R9  Package: 0805  [SMD_Resistor_0805]  (hidden comment: 3.3k)
LS_R10  Package: 0603  [SMD_Resistor_0603]  (hidden comment: 10k)
LS_R11  Package: 0805  [SMD_Resistor_0805]  (hidden comment: 3.3k)

### Sub-sheets
Local-Supply CTRL-A = EPS_Local-Supply_Channel.SchDoc: SUPP_IN (in), SUPP_3V3d (out), SUPP_3V3a (out), SUPP_WDT-RST (in), SUPP_TEMP (out)
Local-Supply CTRL-B = EPS_Local-Supply_Channel.SchDoc: SUPP_IN (in), SUPP_3V3d (out), SUPP_3V3a (out), SUPP_WDT-RST (in), SUPP_TEMP (out)

### Ports
CTRLA_SUPP (harness CTRLA_SUPP), CTRLB_SUPP (harness CTRLB_SUPP), Supply (in)

### Harnesses
CTRLA_SUPP: Temperature, WatchDog-Timer
CTRLB_SUPP: Temperature, WatchDog-Timer

### Nets
CTRLA_3V3d: LS_D1.A LS_R9.2 ; sheet Local-Supply CTRL-A/SUPP_3V3d
CTRLAB_3V3d: LS_R7.2 LS_R8.1 LS_R10.2
CTRLB_3V3d: LS_D2.A LS_R11.2 ; sheet Local-Supply CTRL-B/SUPP_3V3d
DGND: LS_R9.1 LS_R10.1 LS_R11.1
PGND: LS_C2.2 LS_R4.2
CTRLA_HK_SUPP_TEMP: sheet Local-Supply CTRL-A/SUPP_TEMP, port CTRLA_SUPP.Temperature
CTRLB_HK_SUPP_TEMP: sheet Local-Supply CTRL-B/SUPP_TEMP, port CTRLB_SUPP.Temperature
NetCTRLB_U1_42: sheet Local-Supply CTRL-B/SUPP_WDT-RST, port CTRLB_SUPP.WatchDog-Timer
NetDRLCL_C1_1_1: LS_FB1.1 LS_FB2.1 ; port Supply
NetLS_C1_1: LS_C1.1 LS_FB1.2 LS_FB2.2 LS_R2.1 ; sheet Local-Supply CTRL-A/SUPP_IN, sheet Local-Supply CTRL-B/SUPP_IN
NetLS_C1_2: LS_C1.2 LS_C2.1 LS_R2.2 LS_R4.1
NetLS_D1_K: LS_D1.K LS_R7.1
NetLS_D2_K: LS_D2.K LS_R8.2
NetSUPP_R13_1_2: sheet Local-Supply CTRL-A/SUPP_WDT-RST, port CTRLA_SUPP.WatchDog-Timer

### Notes on the sheet
- (near LS_R9) Bleeding resistor
- (near LS_R9) 10k
- (near LS_R11) Bleeding resistor
- (near LS_R11) 10k
- Title:
- Project:
- Author:
- Model:
- Document Number:
- Checked by:
- Rev:
- Date:
- Approved by:
- Sheet:
- of
- File name:

### Library data of the parts
LS_C1 LS_C2 = Cer_C1206T106K4RACTU: Ceramic Cap Kemet COTS 10u/16V X7R 1206; ManufacturerPartNumber: C1206T106K4RACTU; Manufacturer: Kemet; Value: 10u/16V
LS_D1 LS_D2 = 1N4148W: as SEL_D3 on sheet EPS_DCDC_RLCLs; Value: 1N4148W
LS_FB1 LS_FB2 = BLM31PG121SH1L: Ferrite bead, 1206, 0.02HM, 3.5A.; Manufacturer: Murata; Current Rating: 3.5A; Series Resistance DC: 0.02R; Package: 1206; Value: 120R/100MHz; ManufacturerPartNumber: BLM31PG121SH1L
LS_R2 LS_R4 LS_R7-LS_R11 = Res
  LS_R2 LS_R4: Value: 1M/1%
  LS_R7 LS_R8: Value: 51R
  LS_R9 LS_R11: Value: 3.3k
  LS_R10: Value: 10k

## Sheet EPS_Local-Supply_Channel.SchDoc: Local Supply / Channel
size A4; ApprovedBy: (not approved); CheckedBy: (not checked); Author: Piotr Kuligowski; DocumentNumber: PWSat2-xxx-DW-xxx; Revision: 3; SheetNumber: 34; SheetTotal: 51; Model: FPM
Used 2 times, as channels Top/Local-Supply and WDTs/Local-Supply CTRL-A, Top/Local-Supply and WDTs/Local-Supply CTRL-B. Parts and nets are listed once, with the designators drawn on the sheet.
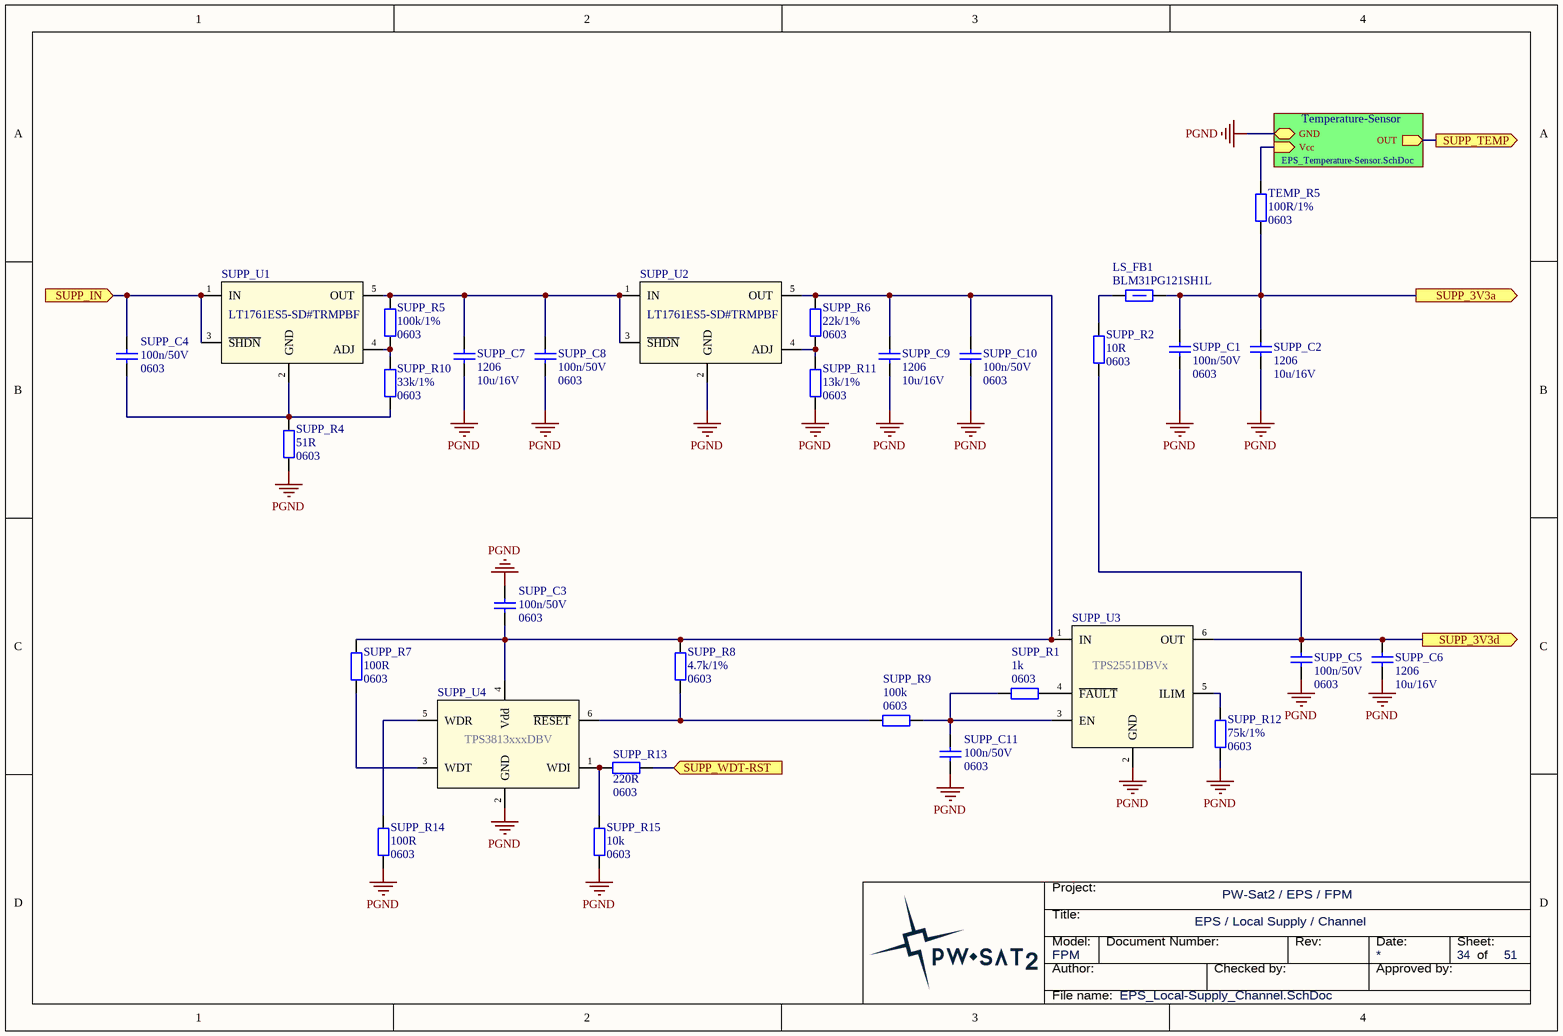
[diagram p31: EPS_Local-Supply_Channel.SchDoc]

### Parts
LS_FB1  120R/100MHz  [SMD_FerriteBead_1206]  (value not drawn)
SUPP_C1  Package: 0603  [SMD_Capacitor_0603]  (hidden comment: 100n/50V)
SUPP_C2  Packge: 1206  [SMD_Capacitor_1206]  (hidden comment: 10u/16V)
SUPP_C3  Package: 0603  [SMD_Capacitor_0603]  (hidden comment: 100n/50V)
SUPP_C4  Package: 0603  [SMD_Capacitor_0603]  (hidden comment: 100n/50V)
SUPP_C5  Package: 0603  [SMD_Capacitor_0603]  (hidden comment: 100n/50V)
SUPP_C6  Packge: 1206  [SMD_Capacitor_1206]  (hidden comment: 10u/16V)
SUPP_C7  Packge: 1206  [SMD_Capacitor_1206]  (hidden comment: 10u/16V)
SUPP_C8  Package: 0603  [SMD_Capacitor_0603]  (hidden comment: 100n/50V)
SUPP_C9  Packge: 1206  [SMD_Capacitor_1206]  (hidden comment: 10u/16V)
SUPP_C10  Package: 0603  [SMD_Capacitor_0603]  (hidden comment: 100n/50V)
SUPP_C11  Package: 0603  [SMD_Capacitor_0603]  (hidden comment: 100n/50V)
SUPP_R1  Package: 0603  [SMD_Resistor_0603]  (hidden comment: 1k)
SUPP_R2  Package: 0603  [SMD_Resistor_0603]  (hidden comment: 10R)
SUPP_R4  Package: 0603  [SMD_Resistor_0603]  (hidden comment: 51R)
SUPP_R5  Package: 0603  [SMD_Resistor_0603]  (hidden comment: 100k/1%)
SUPP_R6  Package: 0603  [SMD_Resistor_0603]  (hidden comment: 22k/1%)
SUPP_R7  Package: 0603  [SMD_Resistor_0603]  (hidden comment: 100R)
SUPP_R8  Package: 0603  [SMD_Resistor_0603]  (hidden comment: 4.7k/1%)
SUPP_R9  Package: 0603  [SMD_Resistor_0603]  (hidden comment: 100k)
SUPP_R10  Package: 0603  [SMD_Resistor_0603]  (hidden comment: 33k/1%)
SUPP_R11  Package: 0603  [SMD_Resistor_0603]  (hidden comment: 13k/1%)
SUPP_R12  Package: 0603  [SMD_Resistor_0603]  (hidden comment: 75k/1%)
SUPP_R13  Package: 0603  [SMD_Resistor_0603]  (hidden comment: 220R)
SUPP_R14  Package: 0603  [SMD_Resistor_0603]  (hidden comment: 100R)
SUPP_R15  Package: 0603  [SMD_Resistor_0603]  (hidden comment: 10k)
SUPP_U1  LT1761ES5-SD#TRMPBF  [SOT23-5]
SUPP_U2  LT1761ES5-SD#TRMPBF  [SOT23-5]
SUPP_U3  TPS2551DBVx  [SOT23-6]
SUPP_U4  TPS3813xxxDBV  [SOT23-6]
TEMP_R5  Package: 0603  [SMD_Resistor_0603]  (hidden comment: 100R/1%)

### Sub-sheets
Temperature-Sensor = EPS_Temperature-Sensor.SchDoc: OUT (out), Vcc (in), GND

### Ports
SUPP_3V3a (out), SUPP_3V3d (out), SUPP_IN (in), SUPP_TEMP (out), SUPP_WDT-RST (in)

### Nets
PGND: SUPP_C1.2 SUPP_C2.2 SUPP_C3.1 SUPP_C5.2 SUPP_C6.2 SUPP_C7.2 SUPP_C8.2 SUPP_C9.2 SUPP_C10.2 SUPP_C11.1 SUPP_R4.2 SUPP_R11.2 SUPP_R12.2 SUPP_R14.2 SUPP_R15.1 SUPP_U2.2(GND) SUPP_U3.2(GND) SUPP_U4.2(GND) ; sheet Temperature-Sensor/GND
SUPP_3V3a: LS_FB1.2 SUPP_C1.1 SUPP_C2.1 TEMP_R5.2 ; port SUPP_3V3a
SUPP_3V3d: SUPP_C5.1 SUPP_C6.1 SUPP_R2.1 SUPP_U3.6(OUT) ; port SUPP_3V3d
SUPP_IN: SUPP_C4.1 SUPP_U1.1(IN) SUPP_U1.3(~{SHDN}) ; port SUPP_IN
SUPP_TEMP: port SUPP_TEMP, sheet Temperature-Sensor/OUT
SUPP_WDT-RST: SUPP_R13.2 ; port SUPP_WDT-RST
NetLS_FB1_1: LS_FB1.1 SUPP_R2.2
NetSUPP_C3_2: SUPP_C3.2 SUPP_C9.1 SUPP_C10.1 SUPP_R6.1 SUPP_R7.1 SUPP_R8.1 SUPP_U2.5(OUT) SUPP_U3.1(IN) SUPP_U4.4(Vdd)
NetSUPP_C4_2: SUPP_C4.2 SUPP_R4.1 SUPP_R10.2 SUPP_U1.2(GND)
NetSUPP_C7_1: SUPP_C7.1 SUPP_C8.1 SUPP_R5.1 SUPP_U1.5(OUT) SUPP_U2.1(IN) SUPP_U2.3(~{SHDN})
NetSUPP_C11_2: SUPP_C11.2 SUPP_R1.2 SUPP_R9.1 SUPP_U3.3(EN)
NetSUPP_R1_1: SUPP_R1.1 SUPP_U3.4(~{FAULT})
NetSUPP_R5_2: SUPP_R5.2 SUPP_R10.1 SUPP_U1.4(ADJ)
NetSUPP_R6_2: SUPP_R6.2 SUPP_R11.1 SUPP_U2.4(ADJ)
NetSUPP_R7_2: SUPP_R7.2 SUPP_U4.3(WDT)
NetSUPP_R8_2: SUPP_R8.2 SUPP_R9.2 SUPP_U4.6(~{RESET})
NetSUPP_R12_1: SUPP_R12.1 SUPP_U3.5(ILIM)
NetSUPP_R13_1: SUPP_R13.1 SUPP_R15.2 SUPP_U4.1(WDI)
NetSUPP_R14_1: SUPP_R14.1 SUPP_U4.5(WDR)
NetTEMP_R5_1: TEMP_R5.1 ; sheet Temperature-Sensor/Vcc

### Channels
Top/Local-Supply and WDTs/Local-Supply CTRL-A: designators end in _1; ports SUPP_3V3a=CTRLA_3V3a SUPP_3V3d=CTRLA_3V3d SUPP_IN=NetLS_C1_1 SUPP_TEMP=CTRLA_HK_SUPP_TEMP SUPP_WDT-RST=NetSUPP_R13_1_2
Top/Local-Supply and WDTs/Local-Supply CTRL-B: designators end in _2; ports SUPP_3V3a=CTRLB_3V3a SUPP_3V3d=CTRLB_3V3d SUPP_IN=NetLS_C1_1 SUPP_TEMP=CTRLB_HK_SUPP_TEMP SUPP_WDT-RST=NetCTRLB_U1_42

### Notes on the sheet
- Title:
- Project:
- Author:
- Model:
- Document Number:
- Checked by:
- Rev:
- Date:
- Approved by:
- Sheet:
- of
- File name:

### Library data of the parts
LS_FB1 = BLM31PG121SH1L: as LS_FB1 on sheet EPS_Local-Supply; Package: 1206; Value: 120R/100MHz; ManufacturerPartNumber: BLM31PG121SH1L
SUPP_C1 SUPP_C3-SUPP_C5 SUPP_C8 SUPP_C10 SUPP_C11 = Cer_C0603T104K5RALTU: Ceramic Cap Kemet COTS 100n/50V X7R 0603; Manufacturer: Kemet; ManufacturerPartNumber: C0603T104K5RALTU; Value: 100n/50V
SUPP_C2 SUPP_C6 SUPP_C7 SUPP_C9 = Cer_C1206T106K4RACTU: Ceramic Cap Kemet COTS 10u/16V X7R 1206; ManufacturerPartNumber: C1206T106K4RACTU; Manufacturer: Kemet; Value: 10u/16V
SUPP_R1 SUPP_R2 SUPP_R4-SUPP_R15 = Res
  SUPP_R1: Value: 1k
  SUPP_R2: Value: 10R
  SUPP_R4: Value: 51R
  SUPP_R5: Value: 100k/1%
  SUPP_R6: Value: 22k/1%
  SUPP_R7 SUPP_R14: Value: 100R
  SUPP_R8: Value: 4.7k/1%
  SUPP_R9: Value: 100k
  SUPP_R10: Value: 33k/1%
  SUPP_R11: Value: 13k/1%
  SUPP_R12: Value: 75k/1%
  SUPP_R13: Value: 220R
  SUPP_R15: Value: 10k
SUPP_U1 SUPP_U2 = LT1761ES5-SD#TRMPBF: 100mA, Regulated, Low Noise, LDO Micropower Regulator in TSOT-23; Manufacturer: Linear Technology; Value: LT1761ES5-SD#TRMPBF
SUPP_U3 = TPS2551DBVx: Adjustable Current-Limited Power-Distribution Switch.; Manufacturer: Texas Instruments; Value: TPS2551DBVx
SUPP_U4 = TPS3813xxxDBV: Processor Supervisory Circuits with Window-Watchdog.; Manufacturer: Texas Instruments; Value: TPS3813xxxDBV
TEMP_R5 = CRCW06031K00FKxxxx: 1k/1% Vishay CRCW 0603 Resistor. 100mW, 100ppm, 75V.; Manufacturer: Vishay; ManufacturerPartNumber: CRCW06031K00FKxxxx; Value: 100R/1%

## Sheet EPS_Battery.SchDoc: Battery
size A4; ApprovedBy: (not approved); CheckedBy: (not checked); Author: Piotr Kuligowski; DocumentNumber: PWSat2-xxx-DW-xxx; Revision: 3; SheetNumber: 25; SheetTotal: 51; Model: FPM
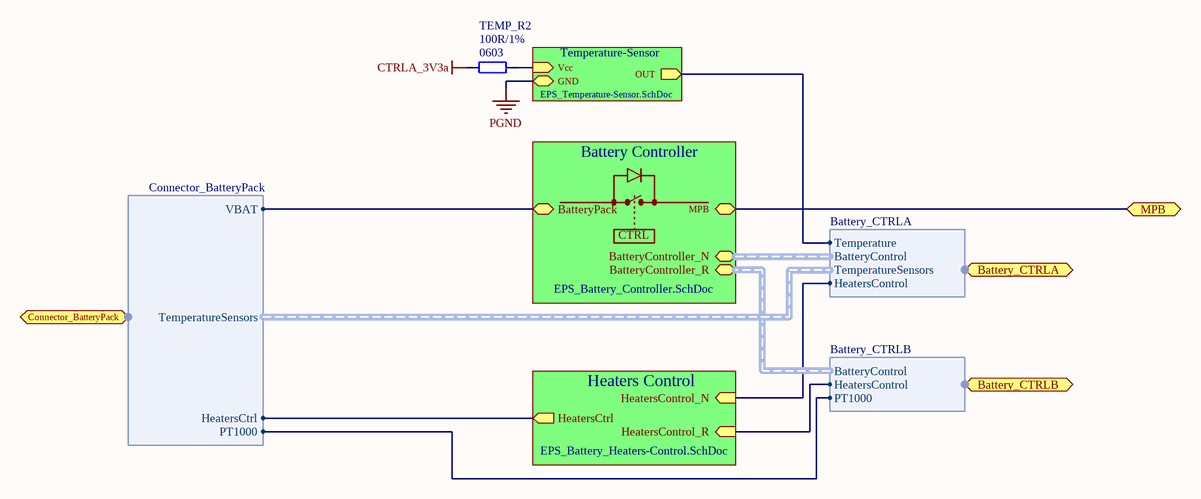
[diagram p32: EPS_Battery.SchDoc]

### Parts
TEMP_R2  Package: 0603  [SMD_Resistor_0603]  (hidden comment: 100R/1%)

### Sub-sheets
Battery Controller = EPS_Battery_Controller.SchDoc: MPB (bidir), BatteryController_N (harness BatteryController_N), BatteryController_R (harness BatteryController_R), BatteryPack
Heaters Control = EPS_Battery_Heaters-Control.SchDoc: HeatersCtrl (out), HeatersControl_N (in), HeatersControl_R (in)
Temperature-Sensor = EPS_Temperature-Sensor.SchDoc: OUT (out), Vcc (in), GND

### Ports
Battery_CTRLA (harness Battery_CTRLA), Battery_CTRLB (harness Battery_CTRLB), Connector_BatteryPack (harness Connector_BatteryPack), MPB (bidir)

### Harnesses
Connector_BatteryPack: VBAT, TemperatureSensors, HeatersCtrl, PT1000
Battery_CTRLA: BatteryControl, HeatersControl, TemperatureSensors, Temperature
Battery_CTRLB: BatteryControl, HeatersControl, PT1000

### Nets
CTRLA_3V3a: TEMP_R2.2
CTRLA_BATC_Heater: sheet Heaters Control/HeatersControl_N, port Battery_CTRLA.HeatersControl
CTRLA_BATC_TEMP: sheet Temperature-Sensor/OUT, port Battery_CTRLA.Temperature
CTRLB_BATC_Heater: sheet Heaters Control/HeatersControl_R, port Battery_CTRLB.HeatersControl
PC-104_Kill-Switch_Pri: port MPB, sheet Battery Controller/MPB
NetBATV_R1_1: sheet Battery Controller/BatteryPack, port Connector_BatteryPack.VBAT
NetCTRLB_C5_1: port Connector_BatteryPack.PT1000, port Battery_CTRLB.PT1000
NetH9_16: sheet Heaters Control/HeatersCtrl, port Connector_BatteryPack.HeatersCtrl
NetTEMP_C1_6_1: TEMP_R2.1 ; sheet Temperature-Sensor/Vcc

### Notes on the sheet
- CTRL
- Title:
- Project:
- Author:
- Model:
- Document Number:
- Checked by:
- Rev:
- Date:
- Approved by:
- Sheet:
- of
- File name:

### Library data of the parts
TEMP_R2 = CRCW06031K00FKxxxx: as TEMP_R5 on sheet EPS_Local-Supply_Channel; Manufacturer: Vishay; ManufacturerPartNumber: CRCW06031K00FKxxxx; Value: 100R/1%

## Sheet EPS_Battery_Controller.SchDoc: Battery / Controller
size A4; ApprovedBy: (not approved); CheckedBy: (not checked); Author: Piotr Kuligowski; DocumentNumber: PWSat2-xxx-DW-xxx; Revision: 3; SheetNumber: 26; SheetTotal: 51; Model: FPM
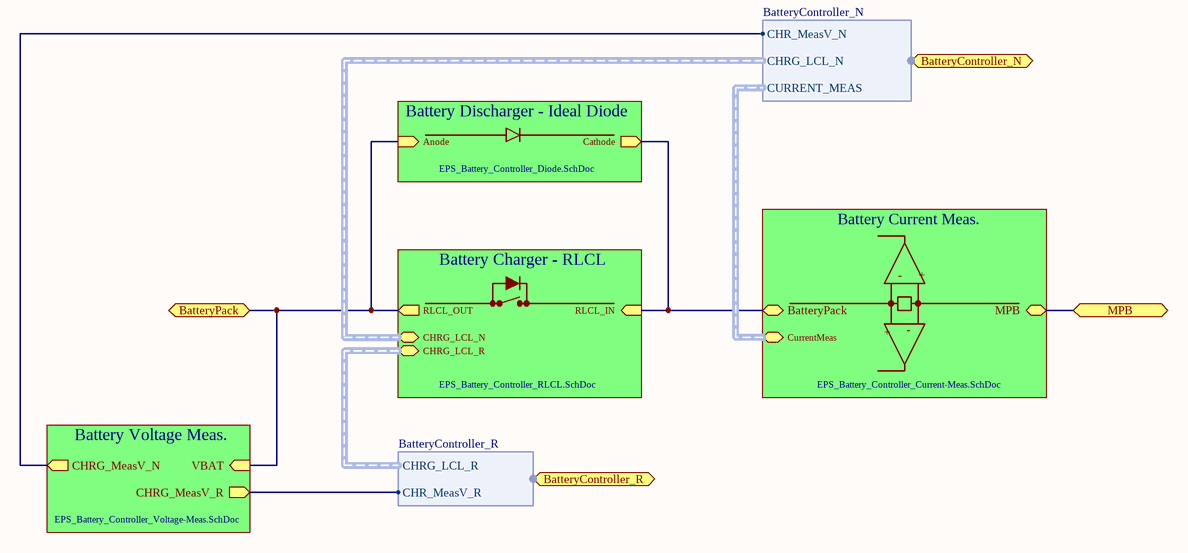
[diagram p33: EPS_Battery_Controller.SchDoc]

### Sub-sheets
Battery Charger - RLCL = EPS_Battery_Controller_RLCL.SchDoc: RLCL_IN (in), RLCL_OUT (out), CHRG_LCL_N (harness CHRG_LCL_N), CHRG_LCL_R (harness CHRG_LCL_R)
Battery Current Meas. = EPS_Battery_Controller_Current-Meas.SchDoc: CurrentMeas (harness CURRENT_MEAS), BatteryPack, MPB (bidir)
Battery Discharger - Ideal Diode = EPS_Battery_Controller_Diode.SchDoc (file not in this document): Cathode (out), Anode (in)
Battery Voltage Meas. = EPS_Battery_Controller_Voltage-Meas.SchDoc: VBAT (in), CHRG_MeasV_R (out), CHRG_MeasV_N (out)

### Ports
BatteryController_N (harness BatteryController_N), BatteryController_R (harness BatteryController_R), BatteryPack, MPB (bidir)

### Harnesses
BatteryController_R: CHRG_LCL_R, CHR_MeasV_R
BatteryController_N: CHRG_LCL_N, CURRENT_MEAS, CHR_MeasV_N

### Nets
BAT_MEAS_VOLTAGE_N: sheet Battery Voltage Meas./CHRG_MeasV_N, port BatteryController_N.CHR_MeasV_N
BAT_MEAS_VOLTAGE_R: sheet Battery Voltage Meas./CHRG_MeasV_R, port BatteryController_R.CHR_MeasV_R
PC-104_Kill-Switch_Pri: port MPB, sheet Battery Current Meas./MPB
NetBATC_R1_1: sheet Battery Current Meas./BatteryPack, sheet Battery Discharger - Ideal Diode/Cathode, sheet Battery Charger - RLCL/RLCL_IN
NetBATV_R1_1: port BatteryPack, sheet Battery Voltage Meas./VBAT, sheet Battery Discharger - Ideal Diode/Anode, sheet Battery Charger - RLCL/RLCL_OUT

### Notes on the sheet
- -
- +
- Title:
- Project:
- Author:
- Model:
- Document Number:
- Checked by:
- Rev:
- Date:
- Approved by:
- Sheet:
- of
- File name:

## Sheet EPS_Battery_Controller_Current-Meas.SchDoc: Battery / Current Measurement
size A4; ApprovedBy: (not approved); CheckedBy: (not checked); Author: Piotr Kuligowski; DocumentNumber: PWSat2-xxx-DW-xxx; Revision: 3; SheetNumber: 29; SheetTotal: 51; Model: FPM
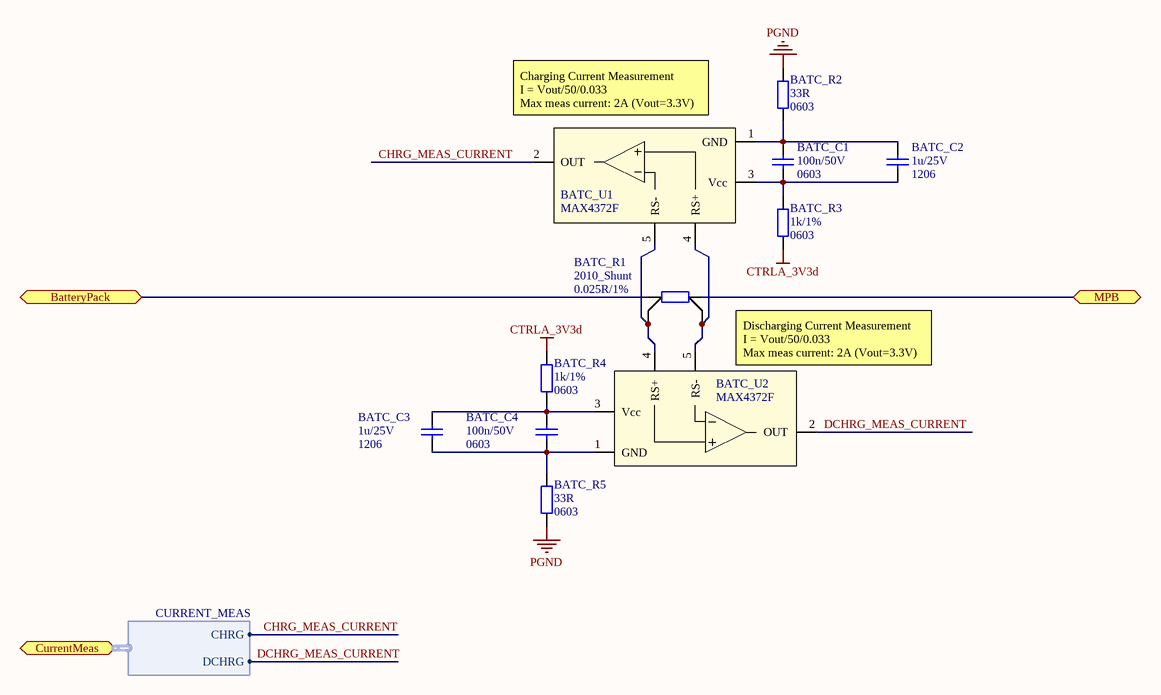
[diagram p34: EPS_Battery_Controller_Current-Meas.SchDoc]

### Parts
BATC_C1  Package: 0603  [SMD_Capacitor_0603]  (hidden comment: 100n/50V)
BATC_C2  Package: 1206  [SMD_Capacitor_1206]  (hidden comment: 1u/25V)
BATC_C3  Package: 1206  [SMD_Capacitor_1206]  (hidden comment: 1u/25V)
BATC_C4  Package: 0603  [SMD_Capacitor_0603]  (hidden comment: 100n/50V)
BATC_R1  Package: 2010_Shunt  [SMD_Resistor-shunt_2010]  (hidden comment: 0.025R/1%)
BATC_R2  Package: 0603  [SMD_Resistor_0603]  (hidden comment: 33R)
BATC_R3  Package: 0603  [SMD_Resistor_0603]  (hidden comment: 1k/1%)
BATC_R4  Package: 0603  [SMD_Resistor_0603]  (hidden comment: 1k/1%)
BATC_R5  Package: 0603  [SMD_Resistor_0603]  (hidden comment: 33R)
BATC_U1  MAX4372F  [SOT23-5]
BATC_U2  MAX4372F  [SOT23-5]

### Ports
BatteryPack, CurrentMeas (harness CURRENT_MEAS), MPB (bidir)

### Harnesses
CURRENT_MEAS: CHRG, DCHRG

### Nets
CTRLA_3V3d: BATC_R3.1 BATC_R4.1
PGND: BATC_R2.2 BATC_R5.1
CHRG_MEAS_CURRENT: BATC_U1.2(OUT) ; port CurrentMeas.CHRG
DCHRG_MEAS_CURRENT: BATC_U2.2(OUT) ; port CurrentMeas.DCHRG  [project net CTRLA_BATC_CURR_DCHRG]
PC-104_Kill-Switch_Pri: BATC_R1.4 ; port MPB
NetBATC_C1_1: BATC_C1.1 BATC_C2.1 BATC_R2.1 BATC_U1.1(GND)
NetBATC_C1_2: BATC_C1.2 BATC_C2.2 BATC_R3.2 BATC_U1.3(Vcc)
NetBATC_C3_1: BATC_C3.1 BATC_C4.1 BATC_R4.2 BATC_U2.3(Vcc)
NetBATC_C3_2: BATC_C3.2 BATC_C4.2 BATC_R5.2 BATC_U2.1(GND)
NetBATC_R1_1: BATC_R1.1 ; port BatteryPack
NetBATC_R1_2: BATC_R1.2 BATC_U1.5(RS-) BATC_U2.4(RS+)
NetBATC_R1_3: BATC_R1.3 BATC_U1.4(RS+) BATC_U2.5(RS-)

### Notes on the sheet
- (near BATC_U1) Charging Current Measurement
  I = Vout/50/0.033
  Max meas current: 2A (Vout=3.3V)
- (near BATC_U2) Discharging Current Measurement
  I = Vout/50/0.033
  Max meas current: 2A (Vout=3.3V)
- Title:
- Project:
- Author:
- Model:
- Document Number:
- Checked by:
- Rev:
- Date:
- Approved by:
- Sheet:
- of
- File name:

### Library data of the parts
BATC_C1 BATC_C4 = Cer_GCJ188R71H104KA12D: as DRLCL_C3 on sheet EPS_DCDC_RLCL-FPF; Manufacturer: Murata; ManufacturerPartNumber: GCJ188R71H104KA12D; Value: 100n/50V
BATC_C2 BATC_C3 = Cer_C1206T105K3RALTU: Ceramic Cap Kemet COTS 1u/25V X7R 1206; ManufacturerPartNumber: C1206T105K3RALTU; Manufacturer: Kemet; Value: 1u/25V
BATC_R1 = CS10FTHTR025: 1W current sensing shunt resistor; Manufacturer: Viking; Supplier 1: TME; TME: CS2010-0R025-1%-HP; ManufacturerPartNumber: CS10FTHTR025; Value: 0.025R/1%
BATC_R2-BATC_R5 = Res
  BATC_R2 BATC_R5: Value: 33R
  BATC_R3 BATC_R4: Value: 1k/1%
BATC_U1 BATC_U2 = MAX4372: High-Side Current-Sense Amplifier with Voltage Output; Manufacturer: Maxim Integrated Products; Value: MAX4372F

## Sheet EPS_Battery_Controller_Voltage-Meas.SchDoc: Battery / Voltage Measurement
size A4; ApprovedBy: (not approved); CheckedBy: (not checked); Author: Piotr Kuligowski; DocumentNumber: PWSat2-xxx-DW-xxx; Revision: 3; SheetNumber: 30; SheetTotal: 51; Model: FPM
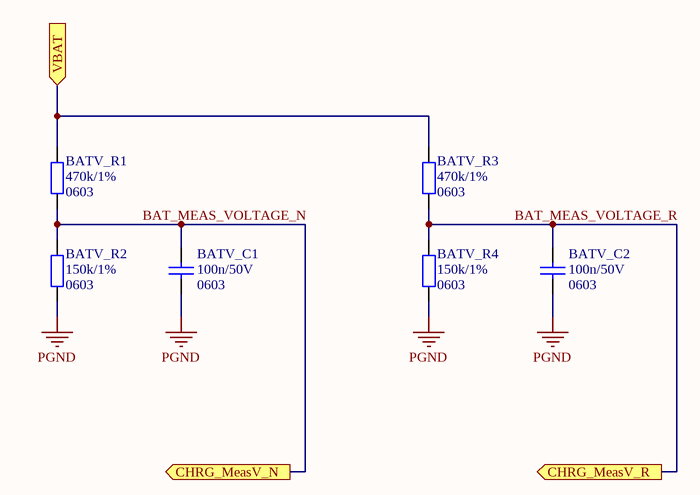
[diagram p35: EPS_Battery_Controller_Voltage-Meas.SchDoc]

### Parts
BATV_C1  Package: 0603  [SMD_Capacitor_0603]  (hidden comment: 100n/50V)
BATV_C2  Package: 0603  [SMD_Capacitor_0603]  (hidden comment: 100n/50V)
BATV_R1  Package: 0603  [SMD_Resistor_0603]  (hidden comment: 470k/1%)
BATV_R2  Package: 0603  [SMD_Resistor_0603]  (hidden comment: 150k/1%)
BATV_R3  Package: 0603  [SMD_Resistor_0603]  (hidden comment: 470k/1%)
BATV_R4  Package: 0603  [SMD_Resistor_0603]  (hidden comment: 150k/1%)

### Ports
CHRG_MeasV_N (out), CHRG_MeasV_R (out), VBAT (in)

### Nets
PGND: BATV_C1.2 BATV_C2.2 BATV_R2.2 BATV_R4.2
BAT_MEAS_VOLTAGE_N: BATV_C1.1 BATV_R1.2 BATV_R2.1 ; port CHRG_MeasV_N
BAT_MEAS_VOLTAGE_R: BATV_C2.1 BATV_R3.2 BATV_R4.1 ; port CHRG_MeasV_R
NetBATV_R1_1: BATV_R1.1 BATV_R3.1 ; port VBAT

### Notes on the sheet
- Title:
- Project:
- Author:
- Model:
- Document Number:
- Checked by:
- Rev:
- Date:
- Approved by:
- Sheet:
- of
- File name:

### Library data of the parts
BATV_C1 BATV_C2 = Cer_C0603T104K5RALTU: Ceramic Cap Kemet COTS 100n/50V X7R 0603; Manufacturer: Kemet; ManufacturerPartNumber: C0603T104K5RALTU; Value: 100n/50V
BATV_R1-BATV_R4 = Res
  BATV_R1 BATV_R3: Value: 470k/1%
  BATV_R2 BATV_R4: Value: 150k/1%

## Sheet EPS_Battery_Controller_RLCL.SchDoc: Battery / Controller / RLCL
size A4; ApprovedBy: (not approved); CheckedBy: (not checked); Author: Piotr Kuligowski; DocumentNumber: PWSat2-xxx-DW-xxx; Revision: 3; SheetNumber: 28; SheetTotal: 51; Model: FPM
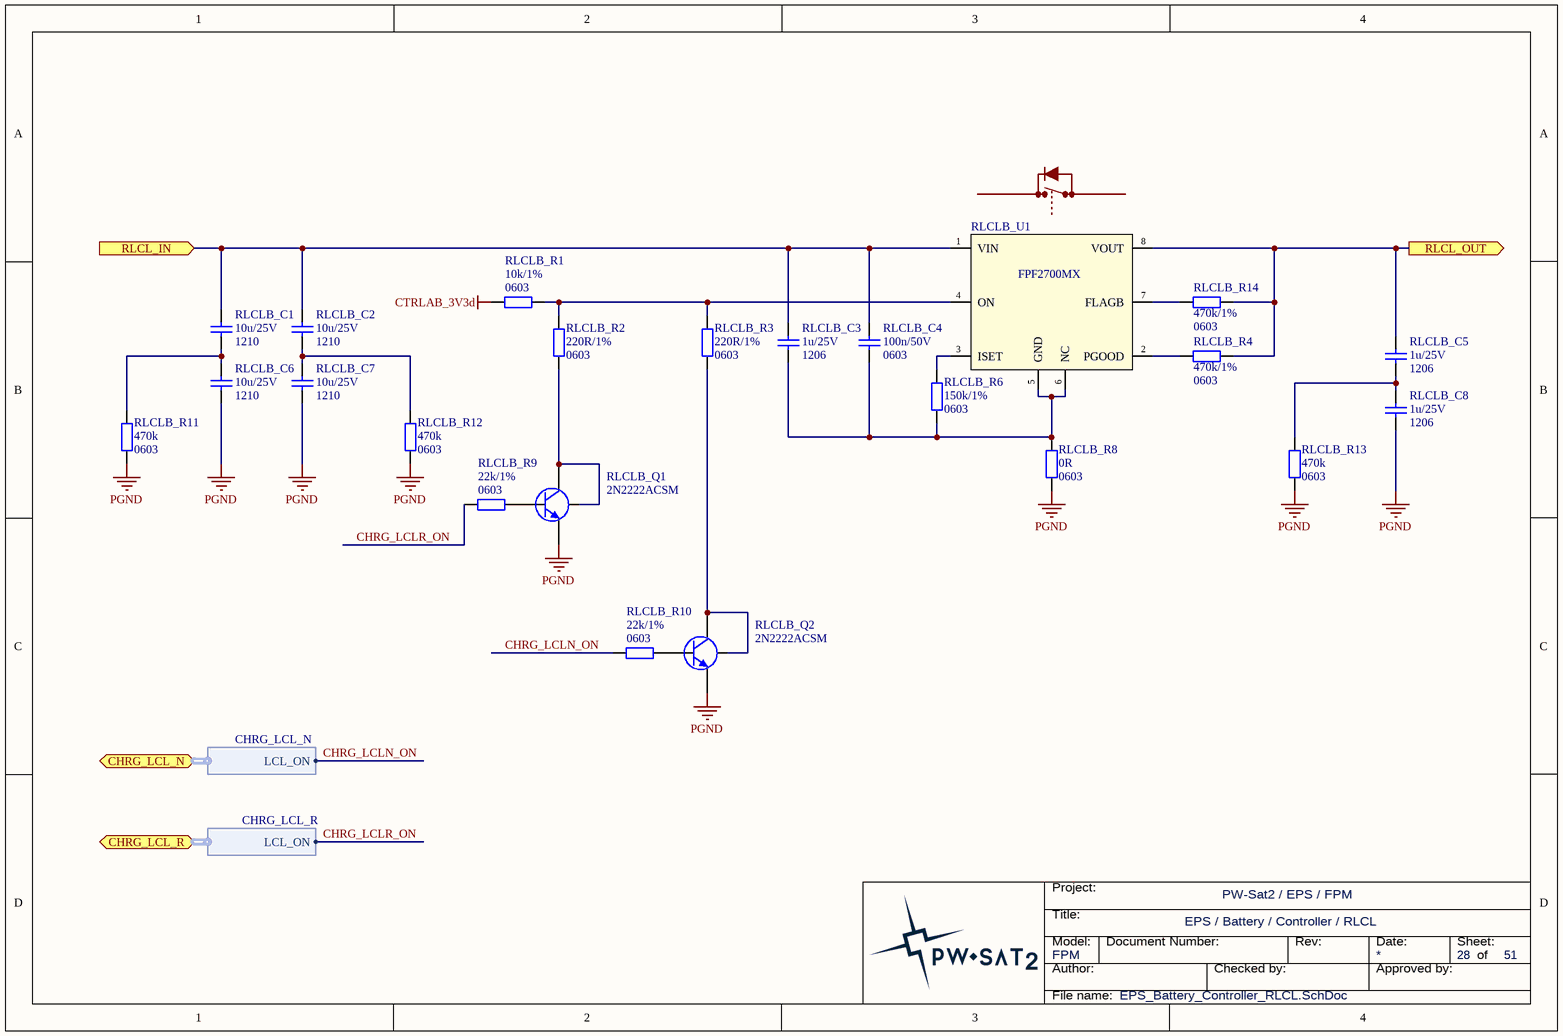
[diagram p36: EPS_Battery_Controller_RLCL.SchDoc]

### Parts
RLCLB_C1  Package: 1210  [SMD_Capacitor_1210]  (hidden comment: 10u/25V)
RLCLB_C2  Package: 1210  [SMD_Capacitor_1210]  (hidden comment: 10u/25V)
RLCLB_C3  Package: 1206  [SMD_Capacitor_1206]  (hidden comment: 1u/25V)
RLCLB_C4  Package: 0603  [SMD_Capacitor_0603]  (hidden comment: 100n/50V)
RLCLB_C5  Package: 1206  [SMD_Capacitor_1206]  (hidden comment: 1u/25V)
RLCLB_C6  Package: 1210  [SMD_Capacitor_1210]  (hidden comment: 10u/25V)
RLCLB_C7  Package: 1210  [SMD_Capacitor_1210]  (hidden comment: 10u/25V)
RLCLB_C8  Package: 1206  [SMD_Capacitor_1206]  (hidden comment: 1u/25V)
RLCLB_Q1  2N2222ACSM  [LCC1-4_BEC]
RLCLB_Q2  2N2222ACSM  [LCC1-4_BEC]
RLCLB_R1  Package: 0603  [SMD_Resistor_0603]  (hidden comment: 10k/1%)
RLCLB_R2  Package: 0603  [SMD_Resistor_0603]  (hidden comment: 220R/1%)
RLCLB_R3  Package: 0603  [SMD_Resistor_0603]  (hidden comment: 220R/1%)
RLCLB_R4  Package: 0603  [SMD_Resistor_0603]  (hidden comment: 470k/1%)
RLCLB_R6  Package: 0603  [SMD_Resistor_0603]  (hidden comment: 150k/1%)
RLCLB_R8  Package: 0603  [SMD_Resistor_0603]  (hidden comment: 0R)
RLCLB_R9  Package: 0603  [SMD_Resistor_0603]  (hidden comment: 22k/1%)
RLCLB_R10  Package: 0603  [SMD_Resistor_0603]  (hidden comment: 22k/1%)
RLCLB_R11  Package: 0603  [SMD_Resistor_0603]  (hidden comment: 470k)
RLCLB_R12  Package: 0603  [SMD_Resistor_0603]  (hidden comment: 470k)
RLCLB_R13  Package: 0603  [SMD_Resistor_0603]  (hidden comment: 470k)
RLCLB_R14  Package: 0603  [SMD_Resistor_0603]  (hidden comment: 470k/1%)
RLCLB_U1  FPF2700MX  [SOIC-8-N]

### Ports
CHRG_LCL_N (harness CHRG_LCL_N), CHRG_LCL_R (harness CHRG_LCL_R), RLCL_IN (in), RLCL_OUT (out)

### Harnesses
CHRG_LCL_N: LCL_ON
CHRG_LCL_R: LCL_ON

### Nets
CTRLAB_3V3d: RLCLB_R1.2
PGND: RLCLB_C6.2 RLCLB_C7.2 RLCLB_C8.2 RLCLB_Q1.E RLCLB_Q2.E RLCLB_R8.2 RLCLB_R11.2 RLCLB_R12.2 RLCLB_R13.2
CHRG_LCLN_ON: RLCLB_R10.1 ; port CHRG_LCL_N.LCL_ON
CHRG_LCLR_ON: RLCLB_R9.1 ; port CHRG_LCL_R.LCL_ON
NetBATC_R1_1: RLCLB_C1.1 RLCLB_C2.1 RLCLB_C3.1 RLCLB_C4.1 RLCLB_U1.1(VIN) ; port RLCL_IN
NetBATV_R1_1: RLCLB_C5.1 RLCLB_R4.2 RLCLB_R14.2 RLCLB_U1.8(VOUT) ; port RLCL_OUT
NetRLCLB_C1_2: RLCLB_C1.2 RLCLB_C6.1 RLCLB_R11.1
NetRLCLB_C2_2: RLCLB_C2.2 RLCLB_C7.1 RLCLB_R12.1
NetRLCLB_C3_2: RLCLB_C3.2 RLCLB_C4.2 RLCLB_R6.2 RLCLB_R8.1 RLCLB_U1.5(GND) RLCLB_U1.6(NC)
NetRLCLB_C5_2: RLCLB_C5.2 RLCLB_C8.1 RLCLB_R13.1
NetRLCLB_Q1_B: RLCLB_Q1.B RLCLB_R9.2
NetRLCLB_Q1_C: RLCLB_Q1.C RLCLB_Q1.Shield RLCLB_R2.2
NetRLCLB_Q2_B: RLCLB_Q2.B RLCLB_R10.2
NetRLCLB_Q2_C: RLCLB_Q2.C RLCLB_Q2.Shield RLCLB_R3.2
NetRLCLB_R1_1: RLCLB_R1.1 RLCLB_R2.1 RLCLB_R3.1 RLCLB_U1.4(ON)
NetRLCLB_R4_1: RLCLB_R4.1 RLCLB_U1.2(PGOOD)
NetRLCLB_R6_1: RLCLB_R6.1 RLCLB_U1.3(ISET)
NetRLCLB_R14_1: RLCLB_R14.1 RLCLB_U1.7(FLAGB)

### Notes on the sheet
- Title:
- Project:
- Author:
- Model:
- Document Number:
- Checked by:
- Rev:
- Date:
- Approved by:
- Sheet:
- of
- File name:

### Library data of the parts
RLCLB_C1 RLCLB_C2 RLCLB_C6 RLCLB_C7 = Cer_GCJ32ER71E106KA12L: Ceramic Cap Murata Automotive 10u/25V X7R 1210; Manufacturer: Murata; ManufacturerPartNumber: GCJ32ER71E106KA12L; Value: 10u/25V
RLCLB_C3 RLCLB_C5 RLCLB_C8 = Cer_C1206T105K3RALTU: Ceramic Cap Kemet COTS 1u/25V X7R 1206; ManufacturerPartNumber: C1206T105K3RALTU; Manufacturer: Kemet; Value: 1u/25V
RLCLB_C4 = Cer_GCJ188R71H104KA12D: as DRLCL_C3 on sheet EPS_DCDC_RLCL-FPF; Manufacturer: Murata; ManufacturerPartNumber: GCJ188R71H104KA12D; Value: 100n/50V
RLCLB_Q1 RLCLB_Q2 = 2N2222ACSM: as SEL_Q1 on sheet EPS_DCDC_RLCLs; Value: 2N2222ACSM
RLCLB_R1-RLCLB_R4 RLCLB_R6 RLCLB_R8-RLCLB_R14 = Res
  RLCLB_R1: Value: 10k/1%
  RLCLB_R2 RLCLB_R3: Value: 220R/1%
  RLCLB_R4 RLCLB_R14: Value: 470k/1%
  RLCLB_R6: Value: 150k/1%
  RLCLB_R8: Value: 0R
  RLCLB_R9 RLCLB_R10: Value: 22k/1%
  RLCLB_R11-RLCLB_R13: Value: 470k
RLCLB_U1 = FPF2700MX: as DRLCL_U1 on sheet EPS_DCDC_RLCL-FPF; Value: FPF2700MX

## Sheet EPS_Battery_Heaters-Control.SchDoc: Battery / Heaters Control
size A4; ApprovedBy: (not approved); CheckedBy: (not checked); Author: Piotr Kuligowski; DocumentNumber: PWSat2-xxx-DW-xxx; Revision: 3; SheetNumber: 31; SheetTotal: 51; Model: FPM
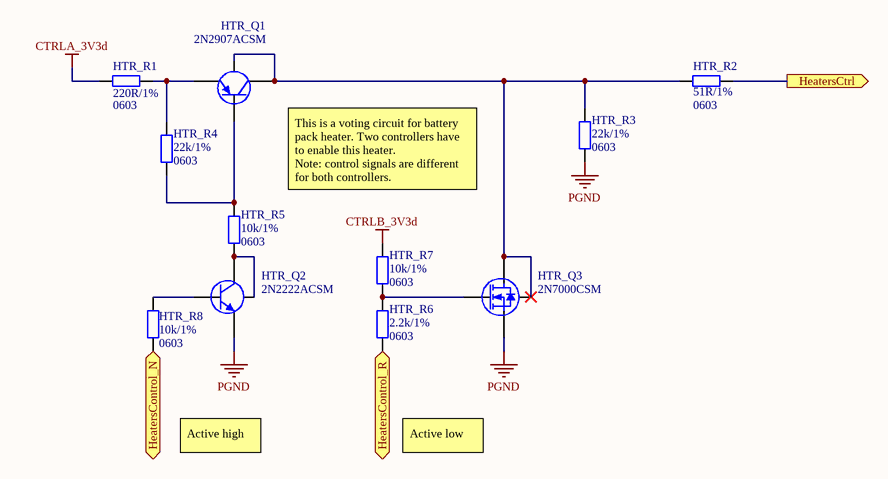
[diagram p37: EPS_Battery_Heaters-Control.SchDoc]

### Parts
HTR_Q1  2N2907ACSM  [LCC1-4_BEC]
HTR_Q2  2N2222ACSM  [LCC1-4_BEC]
HTR_Q3  2N7000CSM  [LCC1-4_GSD]
HTR_R1  Package: 0603  [SMD_Resistor_0603]  (hidden comment: 220R/1%)
HTR_R2  Package: 0603  [SMD_Resistor_0603]  (hidden comment: 51R/1%)
HTR_R3  Package: 0603  [SMD_Resistor_0603]  (hidden comment: 22k/1%)
HTR_R4  Package: 0603  [SMD_Resistor_0603]  (hidden comment: 22k/1%)
HTR_R5  Package: 0603  [SMD_Resistor_0603]  (hidden comment: 10k/1%)
HTR_R6  Package: 0603  [SMD_Resistor_0603]  (hidden comment: 2.2k/1%)
HTR_R7  Package: 0603  [SMD_Resistor_0603]  (hidden comment: 10k/1%)
HTR_R8  Package: 0603  [SMD_Resistor_0603]  (hidden comment: 10k/1%)

### Ports
HeatersControl_N (in), HeatersControl_R (in), HeatersCtrl (out)

### Nets
CTRLA_3V3d: HTR_R1.2
CTRLB_3V3d: HTR_R7.2
PGND: HTR_Q2.E HTR_Q3.S HTR_R3.1
CTRLA_BATC_Heater: HTR_R8.2 ; port HeatersControl_N
CTRLB_BATC_Heater: HTR_R6.1 ; port HeatersControl_R
NetH9_16: HTR_R2.1 ; port HeatersCtrl
NetHTR_Q1_B: HTR_Q1.B HTR_R4.1 HTR_R5.2
NetHTR_Q1_C: HTR_Q1.C HTR_Q1.Shield HTR_Q3.D HTR_Q3.Shield HTR_R2.2 HTR_R3.2
NetHTR_Q1_E: HTR_Q1.E HTR_R1.1 HTR_R4.2
NetHTR_Q2_B: HTR_Q2.B HTR_R8.1
NetHTR_Q2_C: HTR_Q2.C HTR_Q2.Shield HTR_R5.1
NetHTR_Q3_G: HTR_Q3.G HTR_R6.2 HTR_R7.1

### Notes on the sheet
- This is a voting circuit for battery pack heater. Two controllers have to enable this heater.
  Note: control signals are different for both controllers.
- Active high
- Active low
- Title:
- Project:
- Author:
- Model:
- Document Number:
- Checked by:
- Rev:
- Date:
- Approved by:
- Sheet:
- of
- File name:

### Library data of the parts
HTR_Q1 = 2N2907ACSM: Silicon Planar Epitaxial PNP Transistor.; Manufacturer: Semelab-TT; Value: 2N2907ACSM
HTR_Q2 = 2N2222ACSM: as SEL_Q1 on sheet EPS_DCDC_RLCLs; Value: 2N2222ACSM
HTR_Q3 = 2N7000CSM: N-Channel Enhancement Mode MOS Transistor.; Manufacturer: Semelab-TT; Value: 2N7000CSM
HTR_R1-HTR_R8 = Res
  HTR_R1: Value: 220R/1%
  HTR_R2: Value: 51R/1%
  HTR_R3 HTR_R4: Value: 22k/1%
  HTR_R5 HTR_R7 HTR_R8: Value: 10k/1%
  HTR_R6: Value: 2.2k/1%